# EAGLE schematic mt15_pla (EAGLE 6.6.0), part 1 of 2

## Sheet 1 of 9
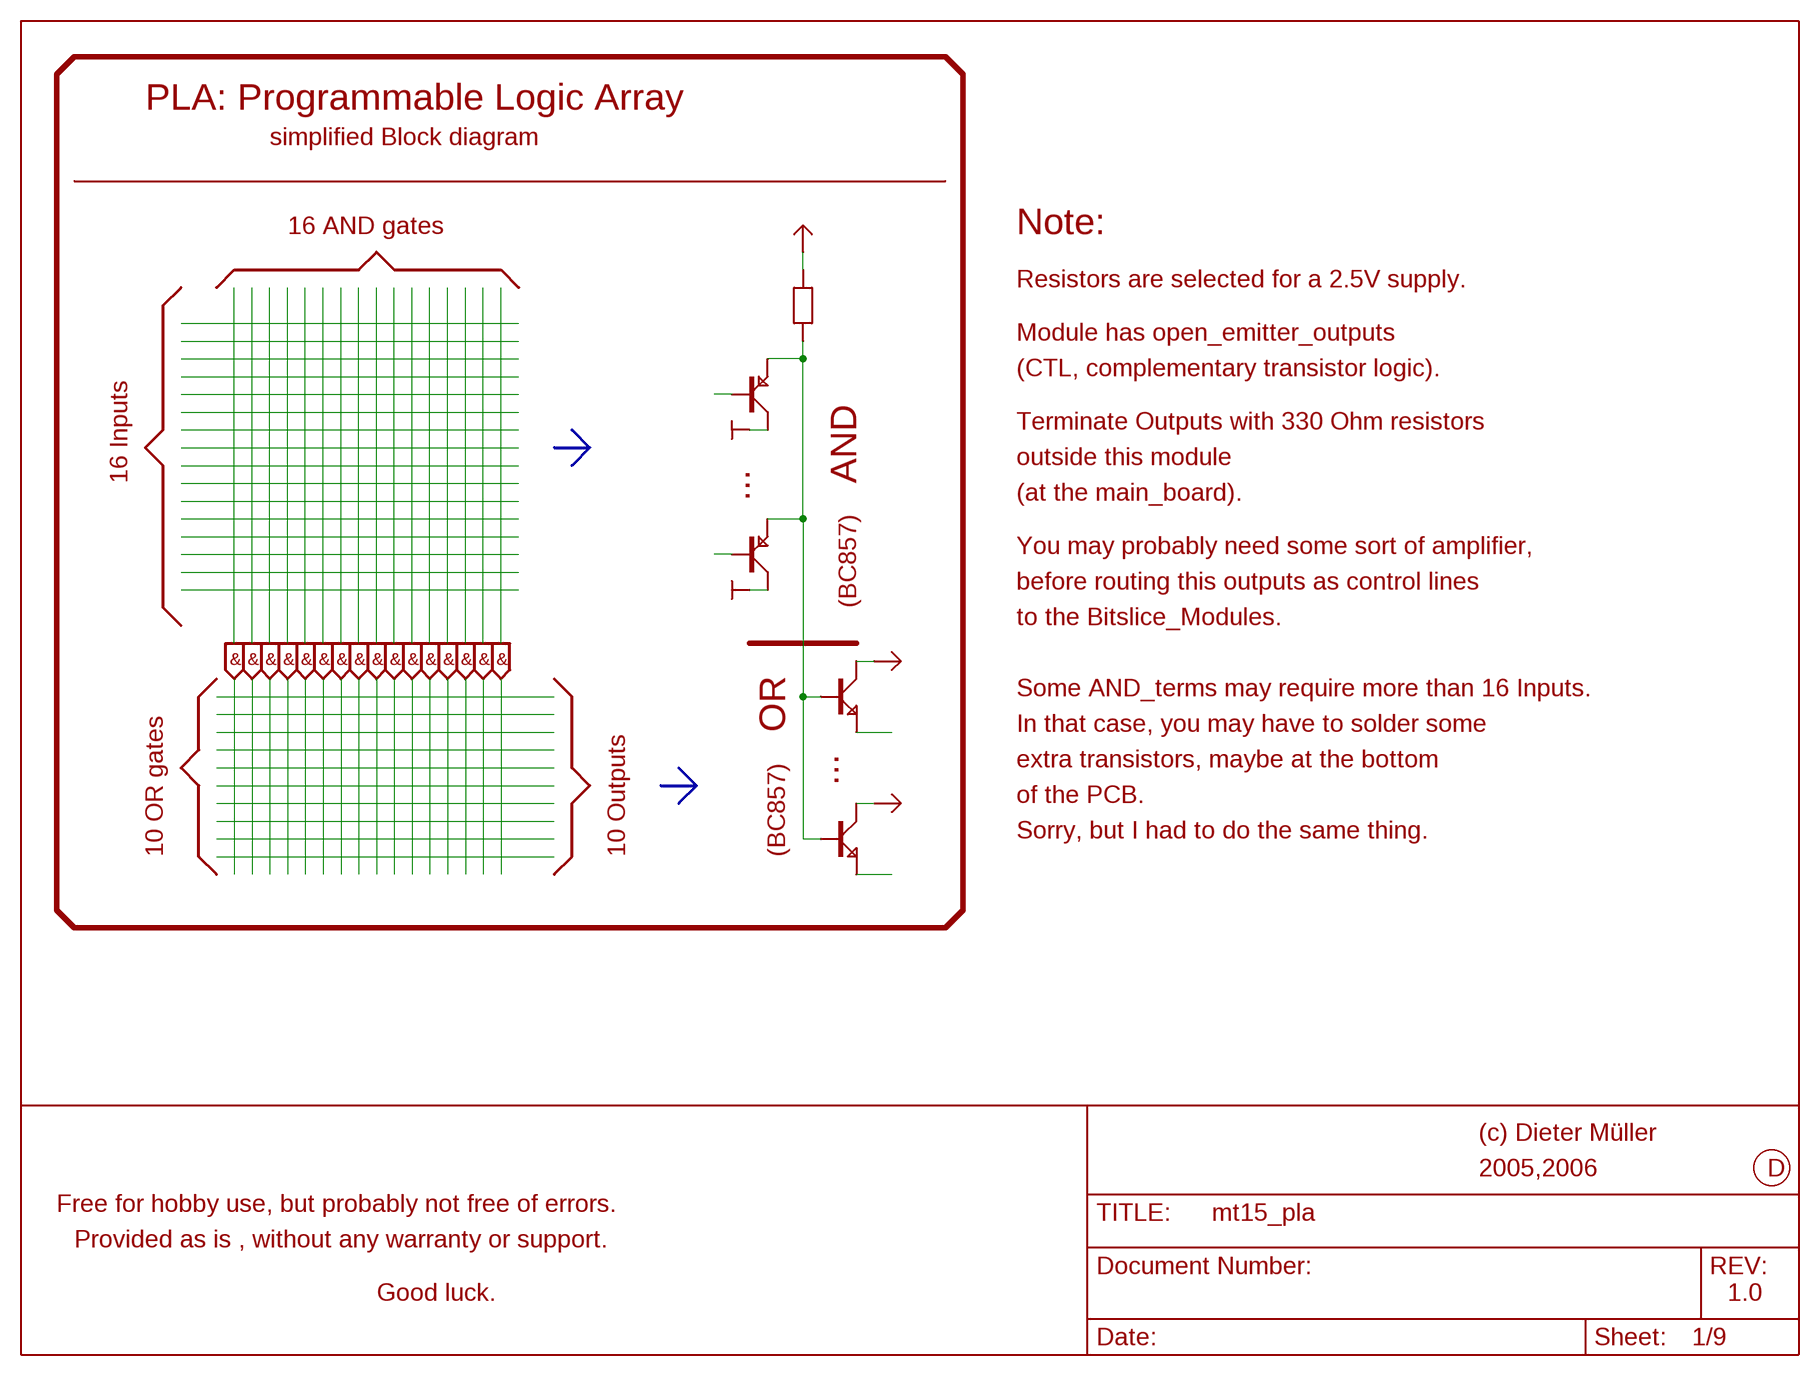
[diagram p0: schematic, sheet 1]

### Buses
B$16
B$17

### Notes on the sheet
- PLA: Programmable Logic Array
- simplified Block diagram
- 16 AND gates | Note:
- Resistors are selected for a 2.5V supply.
- Module has open_emitter_outputs
- (CTL, complementary transistor logic).
- Terminate Outputs with 330 Ohm resistors
- outside this module
- 16 Inputs | AND
- ... | (at the main_board).
- You may probably need some sort of amplifier,
- before routing this outputs as control lines
- (BC857)
- to the Bitslice_Modules.
- & | & | & | & | & | & | & | & | & | & | & | & | & | & | & | &
- Some AND_terms may require more than 16 Inputs.
- OR | In that case, you may have to solder some
- extra transistors, maybe at the bottom
- ...
- of the PCB.
- Sorry, but I had to do the same thing.
- 10 OR gates | 10 Outputs | (BC857)
- (c) Dieter Müller
- 2005,2006 | D
- Free for hobby use, but probably not free of errors.
- Provided as is , without any warranty or support.
- Good luck. | 1.0
- Was die Politiker versprechen, ist schon toll.
- Mit ihren Lügen quatschen sie den Wähler voll.
- All das Reformgebrabbel und die Rangelei.
- Der Wähler sitzt nur da und weint dabei.
- Aber ihre grösste Hoffnung ist,
- dass er diesen ganzen Quatsch vergisst.
- Wenn nicht, dann ist das alles nicht so schlimm.
- Solang' er macht sein Kreuzchen richtig hin.

## Sheet 2 of 9
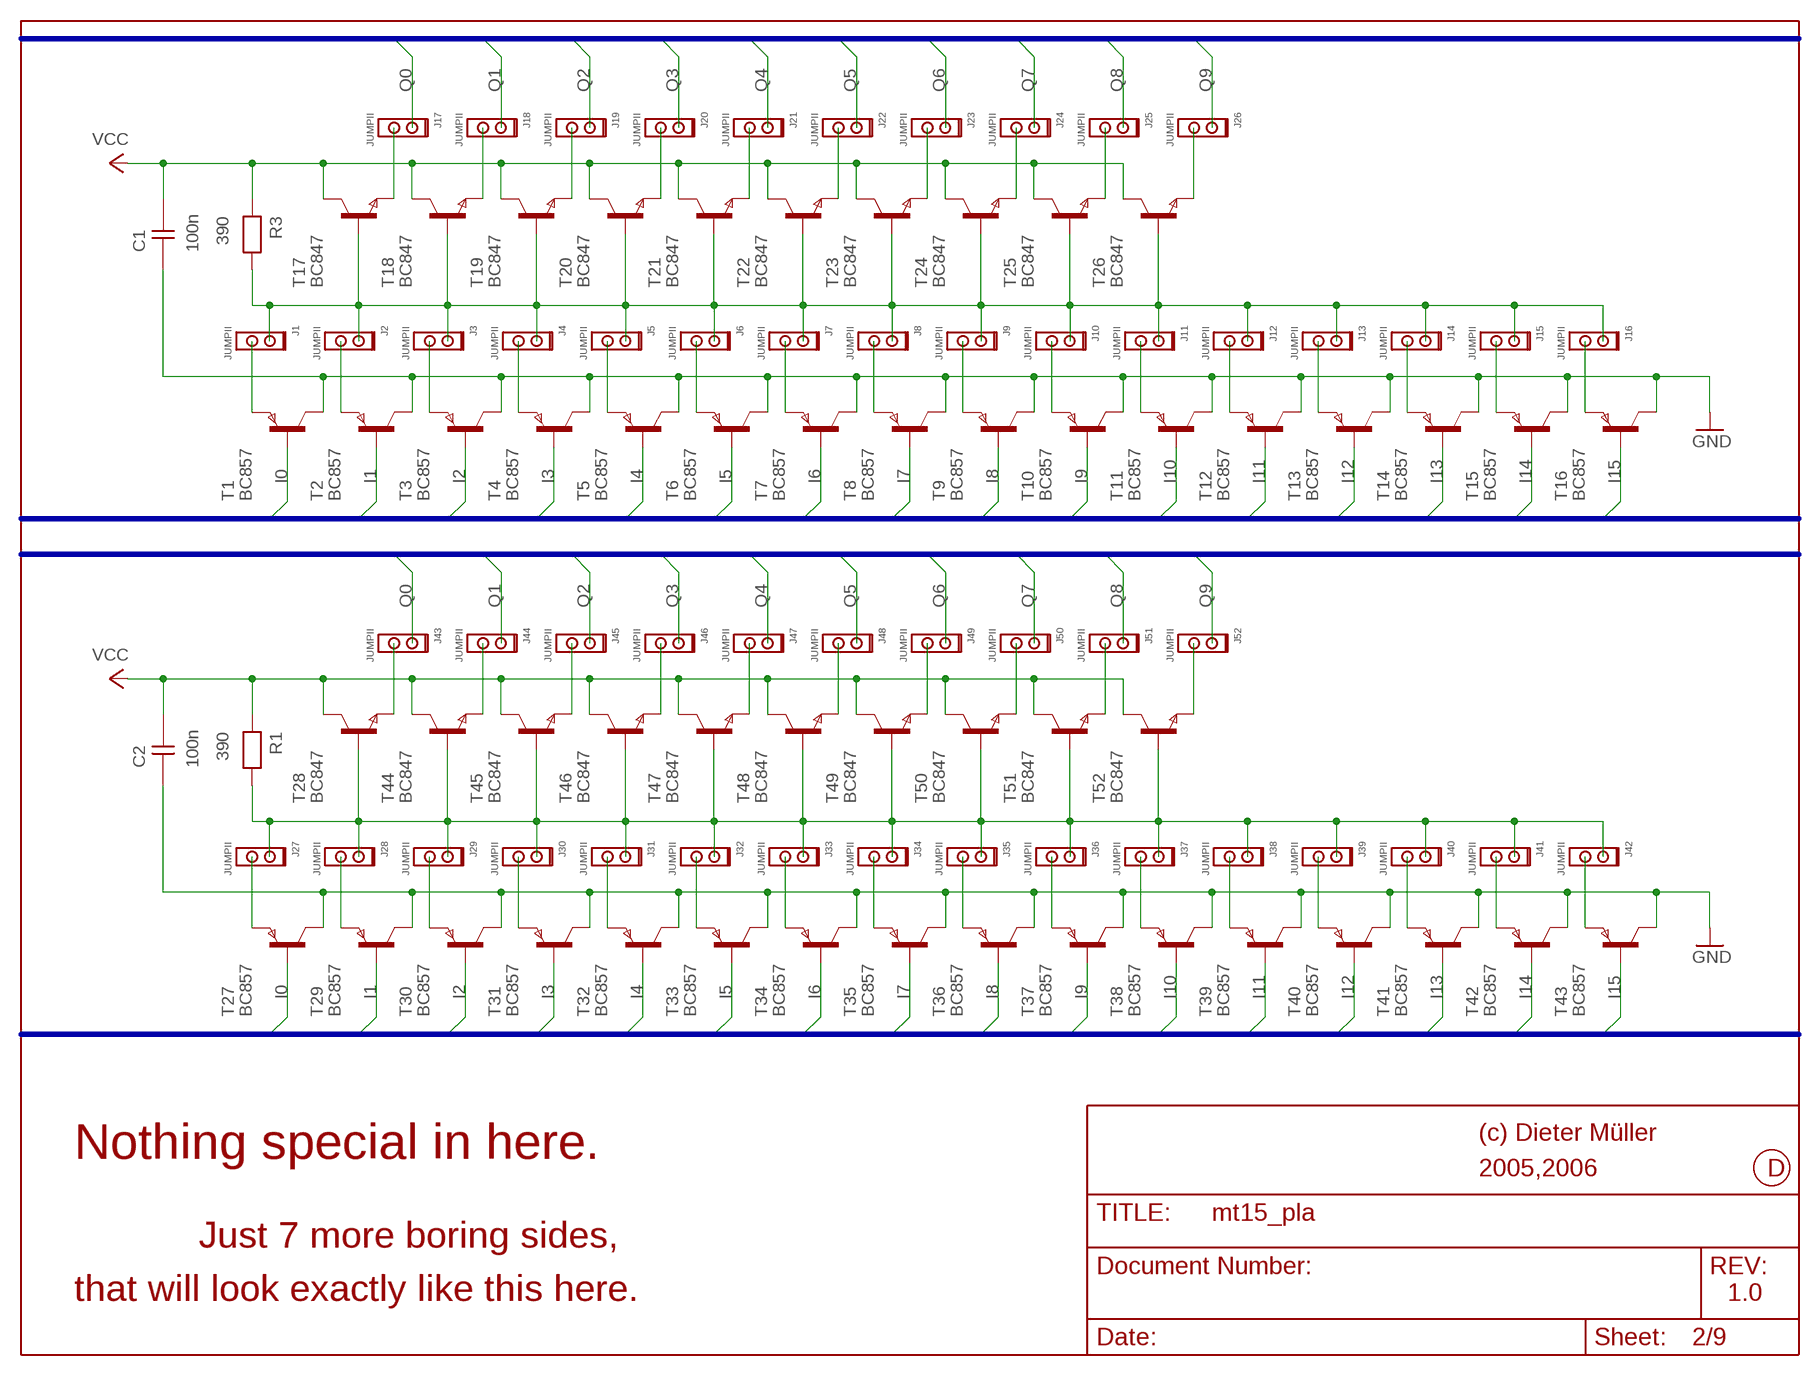
[diagram p1: schematic, sheet 2]

### Parts
C1  100n  CAPNP-5  [0204]
C2  100n  CAPNP-5  [0204]
J1  JUMPII  JUMPII@2  [JUMPII]
J2  JUMPII  JUMPII@2  [JUMPII]
J3  JUMPII  JUMPII@2  [JUMPII]
J4  JUMPII  JUMPII@2  [JUMPII]
J5  JUMPII  JUMPII@2  [JUMPII]
J6  JUMPII  JUMPII@2  [JUMPII]
J7  JUMPII  JUMPII@2  [JUMPII]
J8  JUMPII  JUMPII@2  [JUMPII]
J9  JUMPII  JUMPII@2  [JUMPII]
J10  JUMPII  JUMPII@2  [JUMPII]
J11  JUMPII  JUMPII@2  [JUMPII]
J12  JUMPII  JUMPII@2  [JUMPII]
J13  JUMPII  JUMPII@2  [JUMPII]
J14  JUMPII  JUMPII@2  [JUMPII]
J15  JUMPII  JUMPII@2  [JUMPII]
J16  JUMPII  JUMPII@2  [JUMPII]
J17  JUMPII  JUMPII@2  [JUMPII]
J18  JUMPII  JUMPII@2  [JUMPII]
J19  JUMPII  JUMPII@2  [JUMPII]
J20  JUMPII  JUMPII@2  [JUMPII]
J21  JUMPII  JUMPII@2  [JUMPII]
J22  JUMPII  JUMPII@2  [JUMPII]
J23  JUMPII  JUMPII@2  [JUMPII]
J24  JUMPII  JUMPII@2  [JUMPII]
J25  JUMPII  JUMPII@2  [JUMPII]
J26  JUMPII  JUMPII@2  [JUMPII]
J27  JUMPII  JUMPII@2  [JUMPII]
J28  JUMPII  JUMPII@2  [JUMPII]
J29  JUMPII  JUMPII@2  [JUMPII]
J30  JUMPII  JUMPII@2  [JUMPII]
J31  JUMPII  JUMPII@2  [JUMPII]
J32  JUMPII  JUMPII@2  [JUMPII]
J33  JUMPII  JUMPII@2  [JUMPII]
J34  JUMPII  JUMPII@2  [JUMPII]
J35  JUMPII  JUMPII@2  [JUMPII]
J36  JUMPII  JUMPII@2  [JUMPII]
J37  JUMPII  JUMPII@2  [JUMPII]
J38  JUMPII  JUMPII@2  [JUMPII]
J39  JUMPII  JUMPII@2  [JUMPII]
J40  JUMPII  JUMPII@2  [JUMPII]
J41  JUMPII  JUMPII@2  [JUMPII]
J42  JUMPII  JUMPII@2  [JUMPII]
J43  JUMPII  JUMPII@2  [JUMPII]
J44  JUMPII  JUMPII@2  [JUMPII]
J45  JUMPII  JUMPII@2  [JUMPII]
J46  JUMPII  JUMPII@2  [JUMPII]
J47  JUMPII  JUMPII@2  [JUMPII]
J48  JUMPII  JUMPII@2  [JUMPII]
J49  JUMPII  JUMPII@2  [JUMPII]
J50  JUMPII  JUMPII@2  [JUMPII]
J51  JUMPII  JUMPII@2  [JUMPII]
J52  JUMPII  JUMPII@2  [JUMPII]
R1  390  RESEU-7,5  [0204]
R3  390  RESEU-7,5  [0204]
T1  BC857  BC557  [SOT-23]
T2  BC857  BC557  [SOT-23]
T3  BC857  BC557  [SOT-23]
T4  BC857  BC557  [SOT-23]
T5  BC857  BC557  [SOT-23]
T6  BC857  BC557  [SOT-23]
T7  BC857  BC557  [SOT-23]
T8  BC857  BC557  [SOT-23]
T9  BC857  BC557  [SOT-23]
T10  BC857  BC557  [SOT-23]
T11  BC857  BC557  [SOT-23]
T12  BC857  BC557  [SOT-23]
T13  BC857  BC557  [SOT-23]
T14  BC857  BC557  [SOT-23]
T15  BC857  BC557  [SOT-23]
T16  BC857  BC557  [SOT-23]
T17  BC847  BC547  [SOT-23]
T18  BC847  BC547  [SOT-23]
T19  BC847  BC547  [SOT-23]
T20  BC847  BC547  [SOT-23]
T21  BC847  BC547  [SOT-23]
T22  BC847  BC547  [SOT-23]
T23  BC847  BC547  [SOT-23]
T24  BC847  BC547  [SOT-23]
T25  BC847  BC547  [SOT-23]
T26  BC847  BC547  [SOT-23]
T27  BC857  BC557  [SOT-23]
T28  BC847  BC547  [SOT-23]
T29  BC857  BC557  [SOT-23]
T30  BC857  BC557  [SOT-23]
T31  BC857  BC557  [SOT-23]
T32  BC857  BC557  [SOT-23]
T33  BC857  BC557  [SOT-23]
T34  BC857  BC557  [SOT-23]
T35  BC857  BC557  [SOT-23]
T36  BC857  BC557  [SOT-23]
T37  BC857  BC557  [SOT-23]
T38  BC857  BC557  [SOT-23]
T39  BC857  BC557  [SOT-23]
T40  BC857  BC557  [SOT-23]
T41  BC857  BC557  [SOT-23]
T42  BC857  BC557  [SOT-23]
T43  BC857  BC557  [SOT-23]
T44  BC847  BC547  [SOT-23]
T45  BC847  BC547  [SOT-23]
T46  BC847  BC547  [SOT-23]
T47  BC847  BC547  [SOT-23]
T48  BC847  BC547  [SOT-23]
T49  BC847  BC547  [SOT-23]
T50  BC847  BC547  [SOT-23]
T51  BC847  BC547  [SOT-23]
T52  BC847  BC547  [SOT-23]

### Nets
GND: C1.1 C2.1 T1.3(C) T2.3(C) T3.3(C) T4.3(C) T5.3(C) T6.3(C) T7.3(C) T8.3(C) T9.3(C) T10.3(C) T11.3(C) T12.3(C) T13.3(C) T14.3(C) T15.3(C) T16.3(C) T27.3(C) T29.3(C) T30.3(C) T31.3(C) T32.3(C) T33.3(C) T34.3(C) T35.3(C) T36.3(C) T37.3(C) T38.3(C) T39.3(C) T40.3(C) T41.3(C) T42.3(C) T43.3(C) ; also sheet 1,3,4,5,6,7,8,9
I0: T1.2(B) T27.2(B) ; also sheet 3,4,5,6,7,8,9
I1: T2.2(B) T29.2(B) ; also sheet 3,4,5,6,7,8,9
I2: T3.2(B) T30.2(B) ; also sheet 3,4,5,6,7,8,9
I3: T4.2(B) T31.2(B) ; also sheet 3,4,5,6,7,8,9
I4: T5.2(B) T32.2(B) ; also sheet 3,4,5,6,7,8,9
I5: T6.2(B) T33.2(B) ; also sheet 3,4,5,6,7,8,9
I6: T7.2(B) T34.2(B) ; also sheet 3,4,5,6,7,8,9
I7: T8.2(B) T35.2(B) ; also sheet 3,4,5,6,7,8,9
I8: T9.2(B) T36.2(B) ; also sheet 3,4,5,6,7,8,9
I9: T10.2(B) T37.2(B) ; also sheet 3,4,5,6,7,8,9
I10: T11.2(B) T38.2(B) ; also sheet 3,4,5,6,7,8,9
I11: T12.2(B) T39.2(B) ; also sheet 3,4,5,6,7,8,9
I12: T13.2(B) T40.2(B) ; also sheet 3,4,5,6,7,8,9
I13: T14.2(B) T41.2(B) ; also sheet 3,4,5,6,7,8,9
I14: T15.2(B) T42.2(B) ; also sheet 3,4,5,6,7,8,9
I15: T16.2(B) T43.2(B) ; also sheet 3,4,5,6,7,8,9
N$1: J1.2 T1.1(E)
N$2: J2.2 T2.1(E)
N$3: J3.2 T3.1(E)
N$4: J1.1 J2.1 J3.1 J4.1 J5.1 J6.1 J7.1 J8.1 J9.1 J10.1 J11.1 J12.1 J13.1 J14.1 J15.1 J16.1 R3.2 T17.2(B) T18.2(B) T19.2(B) T20.2(B) T21.2(B) T22.2(B) T23.2(B) T24.2(B) T25.2(B) T26.2(B)
N$5: J16.2 T16.1(E)
N$6: J15.2 T15.1(E)
N$7: J14.2 T14.1(E)
N$8: J13.2 T13.1(E)
N$9: J12.2 T12.1(E)
N$10: J6.2 T6.1(E)
N$11: J5.2 T5.1(E)
N$12: J4.2 T4.1(E)
N$13: J7.2 T7.1(E)
N$14: J8.2 T8.1(E)
N$15: J9.2 T9.1(E)
N$16: J10.2 T10.1(E)
N$17: J11.2 T11.1(E)
N$18: J27.2 T27.1(E)
N$19: J28.2 T29.1(E)
N$20: J29.2 T30.1(E)
N$21: J27.1 J28.1 J29.1 J30.1 J31.1 J32.1 J33.1 J34.1 J35.1 J36.1 J37.1 J38.1 J39.1 J40.1 J41.1 J42.1 R1.2 T28.2(B) T44.2(B) T45.2(B) T46.2(B) T47.2(B) T48.2(B) T49.2(B) T50.2(B) T51.2(B) T52.2(B)
N$22: J42.2 T43.1(E)
N$23: J41.2 T42.1(E)
N$24: J26.2 T26.1(E)
N$25: J17.2 T17.1(E)
N$26: J18.2 T18.1(E)
N$27: J19.2 T19.1(E)
N$28: J20.2 T20.1(E)
N$29: J21.2 T21.1(E)
N$30: J22.2 T22.1(E)
N$31: J23.2 T23.1(E)
N$32: J24.2 T24.1(E)
N$33: J25.2 T25.1(E)
N$34: J40.2 T41.1(E)
N$35: J39.2 T40.1(E)
N$36: J38.2 T39.1(E)
N$37: J32.2 T33.1(E)
N$38: J31.2 T32.1(E)
N$39: J30.2 T31.1(E)
N$40: J33.2 T34.1(E)
N$41: J34.2 T35.1(E)
N$42: J35.2 T36.1(E)
N$43: J36.2 T37.1(E)
N$44: J37.2 T38.1(E)
N$45: J52.2 T52.1(E)
N$46: J43.2 T28.1(E)
N$47: J44.2 T44.1(E)
N$48: J45.2 T45.1(E)
N$49: J46.2 T46.1(E)
N$50: J47.2 T47.1(E)
N$51: J48.2 T48.1(E)
N$52: J49.2 T49.1(E)
N$53: J50.2 T50.1(E)
N$54: J51.2 T51.1(E)
Q0: J17.1 J43.1 ; also sheet 3,4,5,6,7,8,9
Q1: J18.1 J44.1 ; also sheet 3,4,5,6,7,8,9
Q2: J19.1 J45.1 ; also sheet 3,4,5,6,7,8,9
Q3: J20.1 J46.1 ; also sheet 3,4,5,6,7,8,9
Q4: J21.1 J47.1 ; also sheet 3,4,5,6,7,8,9
Q5: J22.1 J48.1 ; also sheet 3,4,5,6,7,8,9
Q6: J23.1 J49.1 ; also sheet 3,4,5,6,7,8,9
Q7: J24.1 J50.1 ; also sheet 3,4,5,6,7,8,9
Q8: J25.1 J51.1 ; also sheet 3,4,5,6,7,8,9
Q9: J26.1 J52.1 ; also sheet 3,4,5,6,7,8,9
VCC: C1.2 C2.2 R1.1 R3.1 T17.3(C) T18.3(C) T19.3(C) T20.3(C) T21.3(C) T22.3(C) T23.3(C) T24.3(C) T25.3(C) T26.3(C) T28.3(C) T44.3(C) T45.3(C) T46.3(C) T47.3(C) T48.3(C) T49.3(C) T50.3(C) T51.3(C) T52.3(C) ; also sheet 1,3,4,5,6,7,8,9

### Buses
B$1
B$3

### Notes on the sheet
- (c) Dieter Müller
- Nothing special in here.
- 2005,2006 | D
- Just 7 more boring sides,
- that will look exactly like this here. | 1.0

## Sheet 3 of 9
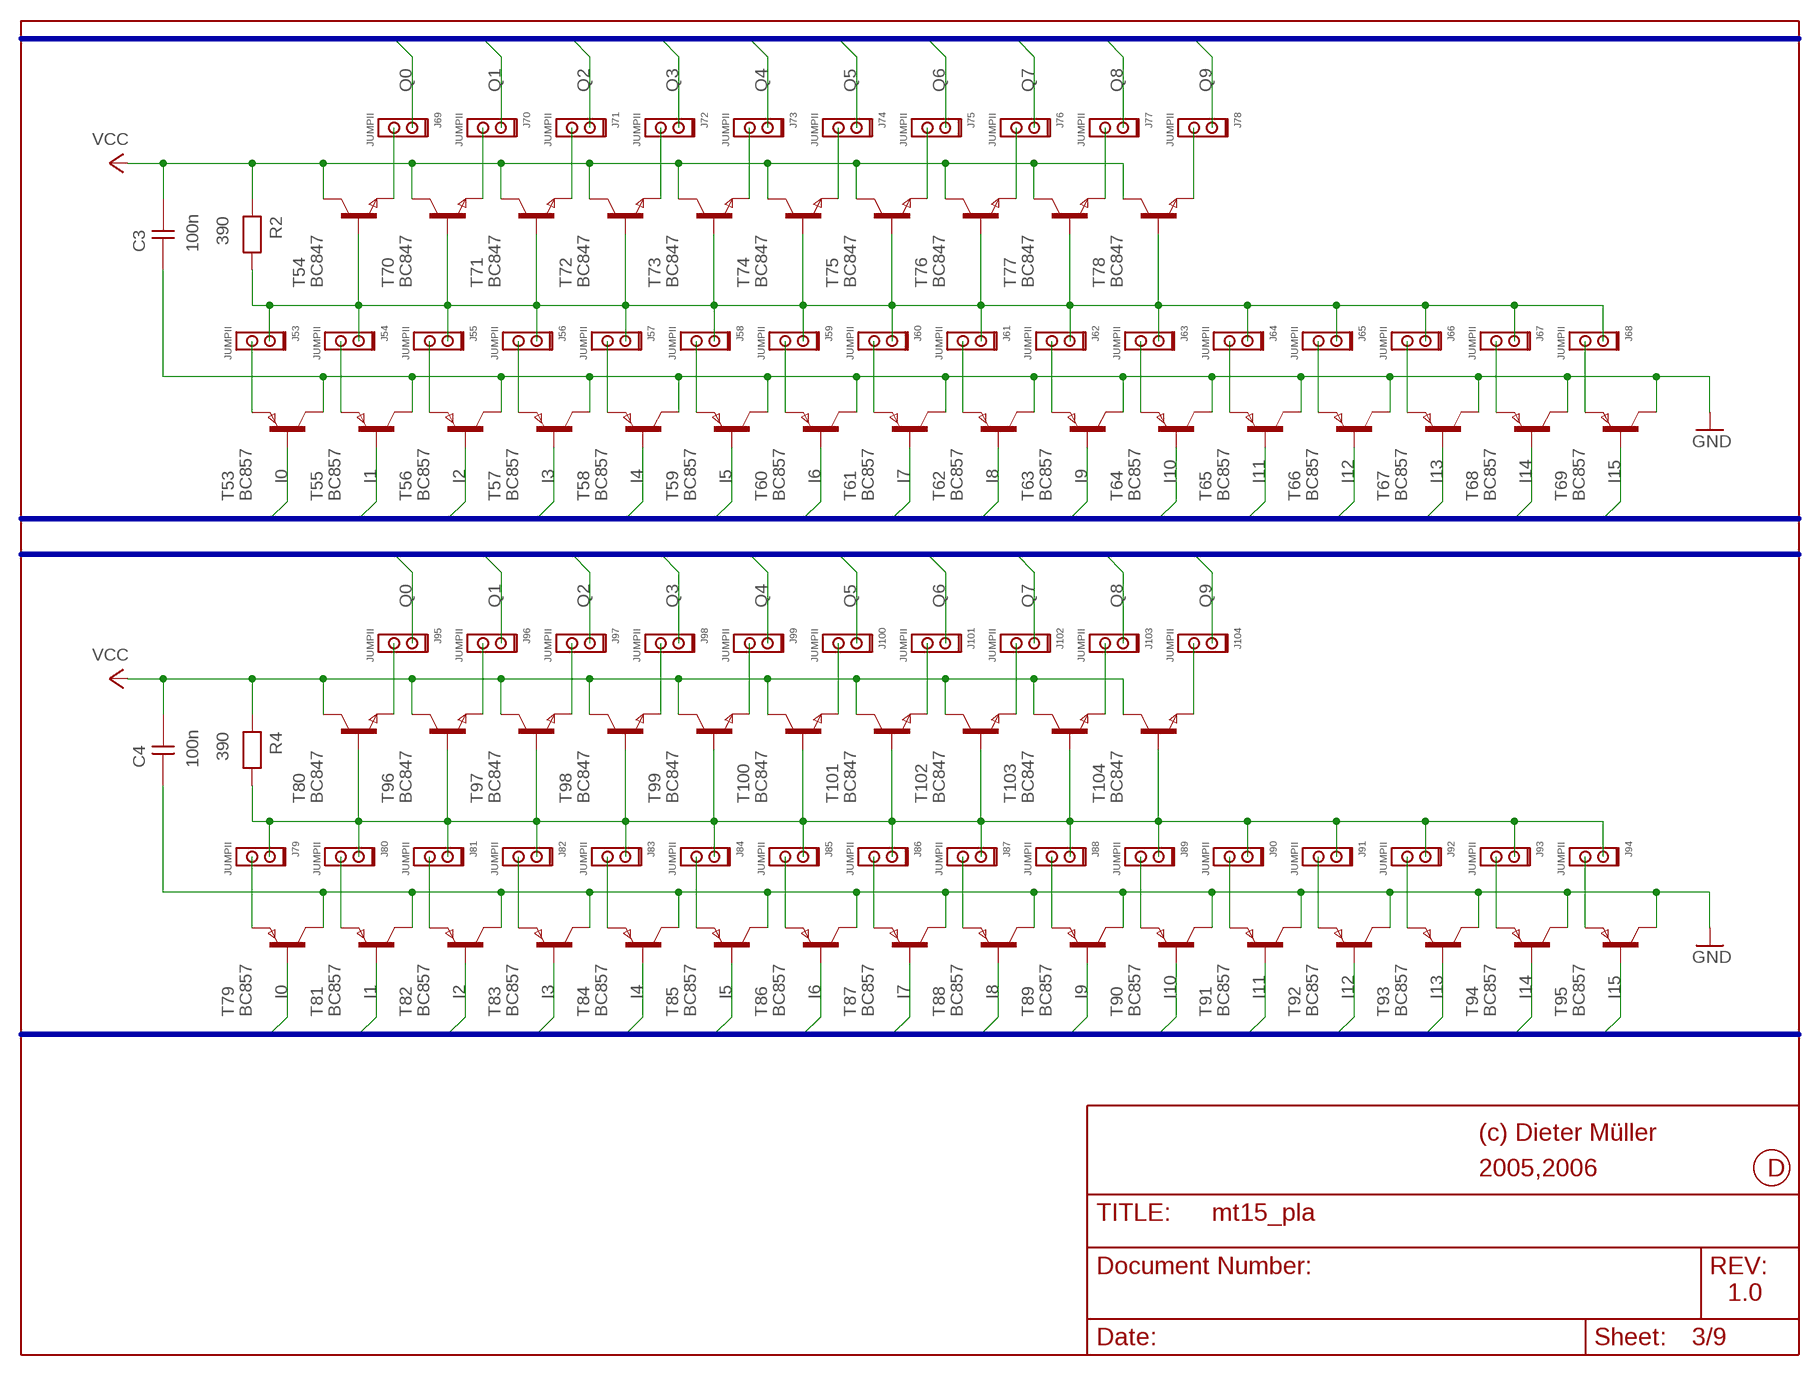
[diagram p2: schematic, sheet 3]

### Parts
C3  100n  CAPNP-5  [0204]
C4  100n  CAPNP-5  [0204]
J53  JUMPII  JUMPII@2  [JUMPII]
J54  JUMPII  JUMPII@2  [JUMPII]
J55  JUMPII  JUMPII@2  [JUMPII]
J56  JUMPII  JUMPII@2  [JUMPII]
J57  JUMPII  JUMPII@2  [JUMPII]
J58  JUMPII  JUMPII@2  [JUMPII]
J59  JUMPII  JUMPII@2  [JUMPII]
J60  JUMPII  JUMPII@2  [JUMPII]
J61  JUMPII  JUMPII@2  [JUMPII]
J62  JUMPII  JUMPII@2  [JUMPII]
J63  JUMPII  JUMPII@2  [JUMPII]
J64  JUMPII  JUMPII@2  [JUMPII]
J65  JUMPII  JUMPII@2  [JUMPII]
J66  JUMPII  JUMPII@2  [JUMPII]
J67  JUMPII  JUMPII@2  [JUMPII]
J68  JUMPII  JUMPII@2  [JUMPII]
J69  JUMPII  JUMPII@2  [JUMPII]
J70  JUMPII  JUMPII@2  [JUMPII]
J71  JUMPII  JUMPII@2  [JUMPII]
J72  JUMPII  JUMPII@2  [JUMPII]
J73  JUMPII  JUMPII@2  [JUMPII]
J74  JUMPII  JUMPII@2  [JUMPII]
J75  JUMPII  JUMPII@2  [JUMPII]
J76  JUMPII  JUMPII@2  [JUMPII]
J77  JUMPII  JUMPII@2  [JUMPII]
J78  JUMPII  JUMPII@2  [JUMPII]
J79  JUMPII  JUMPII@2  [JUMPII]
J80  JUMPII  JUMPII@2  [JUMPII]
J81  JUMPII  JUMPII@2  [JUMPII]
J82  JUMPII  JUMPII@2  [JUMPII]
J83  JUMPII  JUMPII@2  [JUMPII]
J84  JUMPII  JUMPII@2  [JUMPII]
J85  JUMPII  JUMPII@2  [JUMPII]
J86  JUMPII  JUMPII@2  [JUMPII]
J87  JUMPII  JUMPII@2  [JUMPII]
J88  JUMPII  JUMPII@2  [JUMPII]
J89  JUMPII  JUMPII@2  [JUMPII]
J90  JUMPII  JUMPII@2  [JUMPII]
J91  JUMPII  JUMPII@2  [JUMPII]
J92  JUMPII  JUMPII@2  [JUMPII]
J93  JUMPII  JUMPII@2  [JUMPII]
J94  JUMPII  JUMPII@2  [JUMPII]
J95  JUMPII  JUMPII@2  [JUMPII]
J96  JUMPII  JUMPII@2  [JUMPII]
J97  JUMPII  JUMPII@2  [JUMPII]
J98  JUMPII  JUMPII@2  [JUMPII]
J99  JUMPII  JUMPII@2  [JUMPII]
J100  JUMPII  JUMPII@2  [JUMPII]
J101  JUMPII  JUMPII@2  [JUMPII]
J102  JUMPII  JUMPII@2  [JUMPII]
J103  JUMPII  JUMPII@2  [JUMPII]
J104  JUMPII  JUMPII@2  [JUMPII]
R2  390  RESEU-7,5  [0204]
R4  390  RESEU-7,5  [0204]
T53  BC857  BC557  [SOT-23]
T54  BC847  BC547  [SOT-23]
T55  BC857  BC557  [SOT-23]
T56  BC857  BC557  [SOT-23]
T57  BC857  BC557  [SOT-23]
T58  BC857  BC557  [SOT-23]
T59  BC857  BC557  [SOT-23]
T60  BC857  BC557  [SOT-23]
T61  BC857  BC557  [SOT-23]
T62  BC857  BC557  [SOT-23]
T63  BC857  BC557  [SOT-23]
T64  BC857  BC557  [SOT-23]
T65  BC857  BC557  [SOT-23]
T66  BC857  BC557  [SOT-23]
T67  BC857  BC557  [SOT-23]
T68  BC857  BC557  [SOT-23]
T69  BC857  BC557  [SOT-23]
T70  BC847  BC547  [SOT-23]
T71  BC847  BC547  [SOT-23]
T72  BC847  BC547  [SOT-23]
T73  BC847  BC547  [SOT-23]
T74  BC847  BC547  [SOT-23]
T75  BC847  BC547  [SOT-23]
T76  BC847  BC547  [SOT-23]
T77  BC847  BC547  [SOT-23]
T78  BC847  BC547  [SOT-23]
T79  BC857  BC557  [SOT-23]
T80  BC847  BC547  [SOT-23]
T81  BC857  BC557  [SOT-23]
T82  BC857  BC557  [SOT-23]
T83  BC857  BC557  [SOT-23]
T84  BC857  BC557  [SOT-23]
T85  BC857  BC557  [SOT-23]
T86  BC857  BC557  [SOT-23]
T87  BC857  BC557  [SOT-23]
T88  BC857  BC557  [SOT-23]
T89  BC857  BC557  [SOT-23]
T90  BC857  BC557  [SOT-23]
T91  BC857  BC557  [SOT-23]
T92  BC857  BC557  [SOT-23]
T93  BC857  BC557  [SOT-23]
T94  BC857  BC557  [SOT-23]
T95  BC857  BC557  [SOT-23]
T96  BC847  BC547  [SOT-23]
T97  BC847  BC547  [SOT-23]
T98  BC847  BC547  [SOT-23]
T99  BC847  BC547  [SOT-23]
T100  BC847  BC547  [SOT-23]
T101  BC847  BC547  [SOT-23]
T102  BC847  BC547  [SOT-23]
T103  BC847  BC547  [SOT-23]
T104  BC847  BC547  [SOT-23]

### Nets
GND: C3.1 C4.1 T53.3(C) T55.3(C) T56.3(C) T57.3(C) T58.3(C) T59.3(C) T60.3(C) T61.3(C) T62.3(C) T63.3(C) T64.3(C) T65.3(C) T66.3(C) T67.3(C) T68.3(C) T69.3(C) T79.3(C) T81.3(C) T82.3(C) T83.3(C) T84.3(C) T85.3(C) T86.3(C) T87.3(C) T88.3(C) T89.3(C) T90.3(C) T91.3(C) T92.3(C) T93.3(C) T94.3(C) T95.3(C) ; also sheet 1,2,4,5,6,7,8,9
I0: T53.2(B) T79.2(B) ; also sheet 2,4,5,6,7,8,9
I1: T55.2(B) T81.2(B) ; also sheet 2,4,5,6,7,8,9
I2: T56.2(B) T82.2(B) ; also sheet 2,4,5,6,7,8,9
I3: T57.2(B) T83.2(B) ; also sheet 2,4,5,6,7,8,9
I4: T58.2(B) T84.2(B) ; also sheet 2,4,5,6,7,8,9
I5: T59.2(B) T85.2(B) ; also sheet 2,4,5,6,7,8,9
I6: T60.2(B) T86.2(B) ; also sheet 2,4,5,6,7,8,9
I7: T61.2(B) T87.2(B) ; also sheet 2,4,5,6,7,8,9
I8: T62.2(B) T88.2(B) ; also sheet 2,4,5,6,7,8,9
I9: T63.2(B) T89.2(B) ; also sheet 2,4,5,6,7,8,9
I10: T64.2(B) T90.2(B) ; also sheet 2,4,5,6,7,8,9
I11: T65.2(B) T91.2(B) ; also sheet 2,4,5,6,7,8,9
I12: T66.2(B) T92.2(B) ; also sheet 2,4,5,6,7,8,9
I13: T67.2(B) T93.2(B) ; also sheet 2,4,5,6,7,8,9
I14: T68.2(B) T94.2(B) ; also sheet 2,4,5,6,7,8,9
I15: T69.2(B) T95.2(B) ; also sheet 2,4,5,6,7,8,9
N$55: J53.2 T53.1(E)
N$56: J54.2 T55.1(E)
N$57: J55.2 T56.1(E)
N$58: J53.1 J54.1 J55.1 J56.1 J57.1 J58.1 J59.1 J60.1 J61.1 J62.1 J63.1 J64.1 J65.1 J66.1 J67.1 J68.1 R2.2 T54.2(B) T70.2(B) T71.2(B) T72.2(B) T73.2(B) T74.2(B) T75.2(B) T76.2(B) T77.2(B) T78.2(B)
N$59: J68.2 T69.1(E)
N$60: J67.2 T68.1(E)
N$61: J66.2 T67.1(E)
N$62: J65.2 T66.1(E)
N$63: J64.2 T65.1(E)
N$64: J58.2 T59.1(E)
N$65: J57.2 T58.1(E)
N$66: J56.2 T57.1(E)
N$67: J59.2 T60.1(E)
N$68: J60.2 T61.1(E)
N$69: J61.2 T62.1(E)
N$70: J62.2 T63.1(E)
N$71: J63.2 T64.1(E)
N$72: J78.2 T78.1(E)
N$73: J69.2 T54.1(E)
N$74: J70.2 T70.1(E)
N$75: J71.2 T71.1(E)
N$76: J72.2 T72.1(E)
N$77: J73.2 T73.1(E)
N$78: J74.2 T74.1(E)
N$79: J75.2 T75.1(E)
N$80: J76.2 T76.1(E)
N$81: J77.2 T77.1(E)
N$82: J79.2 T79.1(E)
N$83: J80.2 T81.1(E)
N$84: J81.2 T82.1(E)
N$85: J79.1 J80.1 J81.1 J82.1 J83.1 J84.1 J85.1 J86.1 J87.1 J88.1 J89.1 J90.1 J91.1 J92.1 J93.1 J94.1 R4.2 T80.2(B) T96.2(B) T97.2(B) T98.2(B) T99.2(B) T100.2(B) T101.2(B) T102.2(B) T103.2(B) T104.2(B)
N$86: J94.2 T95.1(E)
N$87: J93.2 T94.1(E)
N$88: J92.2 T93.1(E)
N$89: J91.2 T92.1(E)
N$90: J90.2 T91.1(E)
N$91: J84.2 T85.1(E)
N$92: J83.2 T84.1(E)
N$93: J82.2 T83.1(E)
N$94: J85.2 T86.1(E)
N$95: J86.2 T87.1(E)
N$96: J87.2 T88.1(E)
N$97: J88.2 T89.1(E)
N$98: J89.2 T90.1(E)
N$99: J104.2 T104.1(E)
N$100: J95.2 T80.1(E)
N$101: J96.2 T96.1(E)
N$102: J97.2 T97.1(E)
N$103: J98.2 T98.1(E)
N$104: J99.2 T99.1(E)
N$105: J100.2 T100.1(E)
N$106: J101.2 T101.1(E)
N$107: J102.2 T102.1(E)
N$108: J103.2 T103.1(E)
Q0: J69.1 J95.1 ; also sheet 2,4,5,6,7,8,9
Q1: J70.1 J96.1 ; also sheet 2,4,5,6,7,8,9
Q2: J71.1 J97.1 ; also sheet 2,4,5,6,7,8,9
Q3: J72.1 J98.1 ; also sheet 2,4,5,6,7,8,9
Q4: J73.1 J99.1 ; also sheet 2,4,5,6,7,8,9
Q5: J74.1 J100.1 ; also sheet 2,4,5,6,7,8,9
Q6: J75.1 J101.1 ; also sheet 2,4,5,6,7,8,9
Q7: J76.1 J102.1 ; also sheet 2,4,5,6,7,8,9
Q8: J77.1 J103.1 ; also sheet 2,4,5,6,7,8,9
Q9: J78.1 J104.1 ; also sheet 2,4,5,6,7,8,9
VCC: C3.2 C4.2 R2.1 R4.1 T54.3(C) T70.3(C) T71.3(C) T72.3(C) T73.3(C) T74.3(C) T75.3(C) T76.3(C) T77.3(C) T78.3(C) T80.3(C) T96.3(C) T97.3(C) T98.3(C) T99.3(C) T100.3(C) T101.3(C) T102.3(C) T103.3(C) T104.3(C) ; also sheet 1,2,4,5,6,7,8,9

### Buses
B$1
B$3

### Notes on the sheet
- (c) Dieter Müller
- 2005,2006 | D
- 1.0

## Sheet 4 of 9
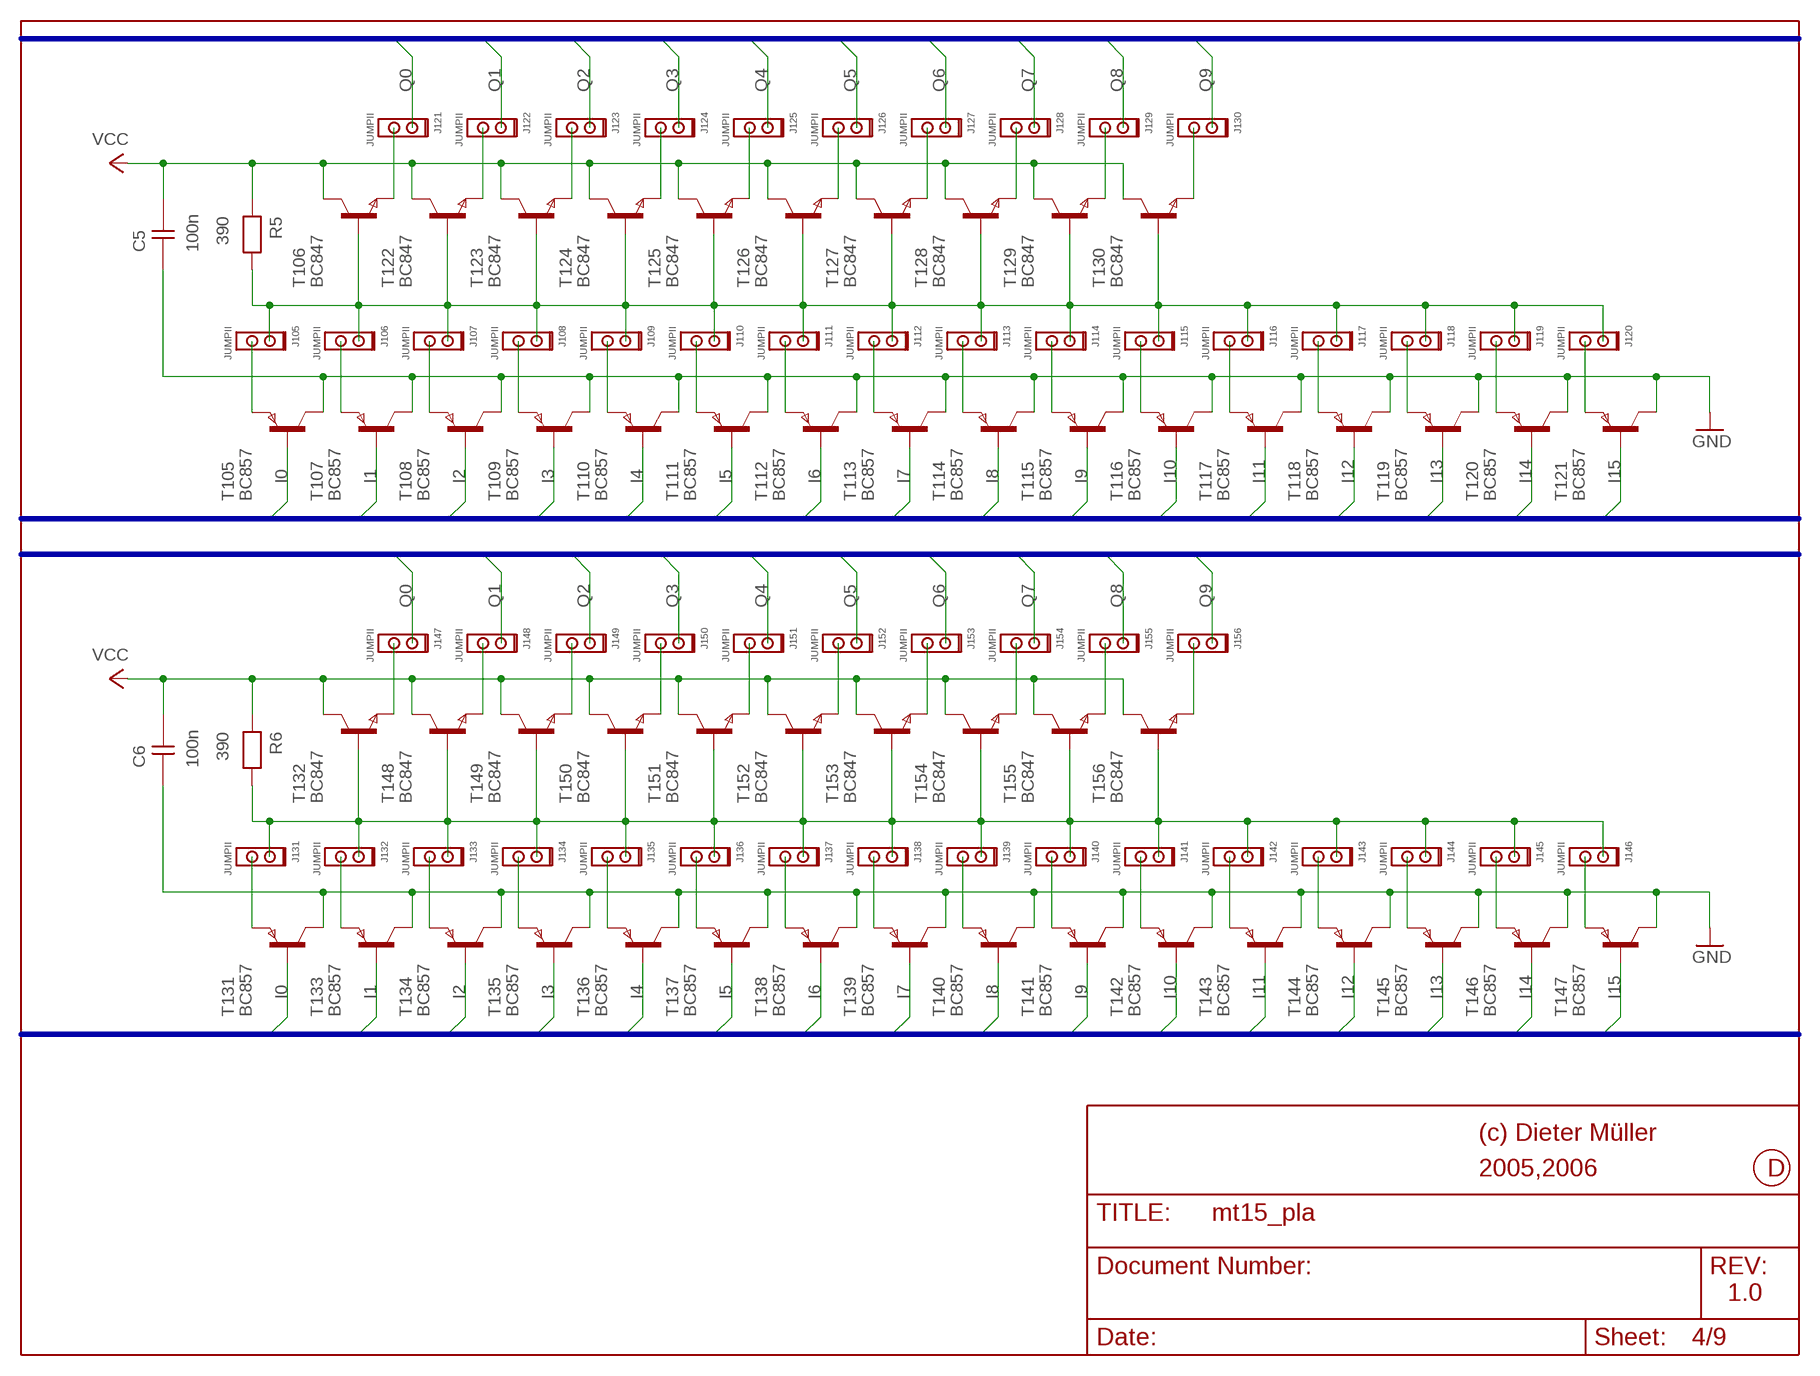
[diagram p3: schematic, sheet 4]

### Parts
C5  100n  CAPNP-5  [0204]
C6  100n  CAPNP-5  [0204]
J105  JUMPII  JUMPII@2  [JUMPII]
J106  JUMPII  JUMPII@2  [JUMPII]
J107  JUMPII  JUMPII@2  [JUMPII]
J108  JUMPII  JUMPII@2  [JUMPII]
J109  JUMPII  JUMPII@2  [JUMPII]
J110  JUMPII  JUMPII@2  [JUMPII]
J111  JUMPII  JUMPII@2  [JUMPII]
J112  JUMPII  JUMPII@2  [JUMPII]
J113  JUMPII  JUMPII@2  [JUMPII]
J114  JUMPII  JUMPII@2  [JUMPII]
J115  JUMPII  JUMPII@2  [JUMPII]
J116  JUMPII  JUMPII@2  [JUMPII]
J117  JUMPII  JUMPII@2  [JUMPII]
J118  JUMPII  JUMPII@2  [JUMPII]
J119  JUMPII  JUMPII@2  [JUMPII]
J120  JUMPII  JUMPII@2  [JUMPII]
J121  JUMPII  JUMPII@2  [JUMPII]
J122  JUMPII  JUMPII@2  [JUMPII]
J123  JUMPII  JUMPII@2  [JUMPII]
J124  JUMPII  JUMPII@2  [JUMPII]
J125  JUMPII  JUMPII@2  [JUMPII]
J126  JUMPII  JUMPII@2  [JUMPII]
J127  JUMPII  JUMPII@2  [JUMPII]
J128  JUMPII  JUMPII@2  [JUMPII]
J129  JUMPII  JUMPII@2  [JUMPII]
J130  JUMPII  JUMPII@2  [JUMPII]
J131  JUMPII  JUMPII@2  [JUMPII]
J132  JUMPII  JUMPII@2  [JUMPII]
J133  JUMPII  JUMPII@2  [JUMPII]
J134  JUMPII  JUMPII@2  [JUMPII]
J135  JUMPII  JUMPII@2  [JUMPII]
J136  JUMPII  JUMPII@2  [JUMPII]
J137  JUMPII  JUMPII@2  [JUMPII]
J138  JUMPII  JUMPII@2  [JUMPII]
J139  JUMPII  JUMPII@2  [JUMPII]
J140  JUMPII  JUMPII@2  [JUMPII]
J141  JUMPII  JUMPII@2  [JUMPII]
J142  JUMPII  JUMPII@2  [JUMPII]
J143  JUMPII  JUMPII@2  [JUMPII]
J144  JUMPII  JUMPII@2  [JUMPII]
J145  JUMPII  JUMPII@2  [JUMPII]
J146  JUMPII  JUMPII@2  [JUMPII]
J147  JUMPII  JUMPII@2  [JUMPII]
J148  JUMPII  JUMPII@2  [JUMPII]
J149  JUMPII  JUMPII@2  [JUMPII]
J150  JUMPII  JUMPII@2  [JUMPII]
J151  JUMPII  JUMPII@2  [JUMPII]
J152  JUMPII  JUMPII@2  [JUMPII]
J153  JUMPII  JUMPII@2  [JUMPII]
J154  JUMPII  JUMPII@2  [JUMPII]
J155  JUMPII  JUMPII@2  [JUMPII]
J156  JUMPII  JUMPII@2  [JUMPII]
R5  390  RESEU-7,5  [0204]
R6  390  RESEU-7,5  [0204]
T105  BC857  BC557  [SOT-23]
T106  BC847  BC547  [SOT-23]
T107  BC857  BC557  [SOT-23]
T108  BC857  BC557  [SOT-23]
T109  BC857  BC557  [SOT-23]
T110  BC857  BC557  [SOT-23]
T111  BC857  BC557  [SOT-23]
T112  BC857  BC557  [SOT-23]
T113  BC857  BC557  [SOT-23]
T114  BC857  BC557  [SOT-23]
T115  BC857  BC557  [SOT-23]
T116  BC857  BC557  [SOT-23]
T117  BC857  BC557  [SOT-23]
T118  BC857  BC557  [SOT-23]
T119  BC857  BC557  [SOT-23]
T120  BC857  BC557  [SOT-23]
T121  BC857  BC557  [SOT-23]
T122  BC847  BC547  [SOT-23]
T123  BC847  BC547  [SOT-23]
T124  BC847  BC547  [SOT-23]
T125  BC847  BC547  [SOT-23]
T126  BC847  BC547  [SOT-23]
T127  BC847  BC547  [SOT-23]
T128  BC847  BC547  [SOT-23]
T129  BC847  BC547  [SOT-23]
T130  BC847  BC547  [SOT-23]
T131  BC857  BC557  [SOT-23]
T132  BC847  BC547  [SOT-23]
T133  BC857  BC557  [SOT-23]
T134  BC857  BC557  [SOT-23]
T135  BC857  BC557  [SOT-23]
T136  BC857  BC557  [SOT-23]
T137  BC857  BC557  [SOT-23]
T138  BC857  BC557  [SOT-23]
T139  BC857  BC557  [SOT-23]
T140  BC857  BC557  [SOT-23]
T141  BC857  BC557  [SOT-23]
T142  BC857  BC557  [SOT-23]
T143  BC857  BC557  [SOT-23]
T144  BC857  BC557  [SOT-23]
T145  BC857  BC557  [SOT-23]
T146  BC857  BC557  [SOT-23]
T147  BC857  BC557  [SOT-23]
T148  BC847  BC547  [SOT-23]
T149  BC847  BC547  [SOT-23]
T150  BC847  BC547  [SOT-23]
T151  BC847  BC547  [SOT-23]
T152  BC847  BC547  [SOT-23]
T153  BC847  BC547  [SOT-23]
T154  BC847  BC547  [SOT-23]
T155  BC847  BC547  [SOT-23]
T156  BC847  BC547  [SOT-23]

### Nets
GND: C5.1 C6.1 T105.3(C) T107.3(C) T108.3(C) T109.3(C) T110.3(C) T111.3(C) T112.3(C) T113.3(C) T114.3(C) T115.3(C) T116.3(C) T117.3(C) T118.3(C) T119.3(C) T120.3(C) T121.3(C) T131.3(C) T133.3(C) T134.3(C) T135.3(C) T136.3(C) T137.3(C) T138.3(C) T139.3(C) T140.3(C) T141.3(C) T142.3(C) T143.3(C) T144.3(C) T145.3(C) T146.3(C) T147.3(C) ; also sheet 1,2,3,5,6,7,8,9
I0: T105.2(B) T131.2(B) ; also sheet 2,3,5,6,7,8,9
I1: T107.2(B) T133.2(B) ; also sheet 2,3,5,6,7,8,9
I2: T108.2(B) T134.2(B) ; also sheet 2,3,5,6,7,8,9
I3: T109.2(B) T135.2(B) ; also sheet 2,3,5,6,7,8,9
I4: T110.2(B) T136.2(B) ; also sheet 2,3,5,6,7,8,9
I5: T111.2(B) T137.2(B) ; also sheet 2,3,5,6,7,8,9
I6: T112.2(B) T138.2(B) ; also sheet 2,3,5,6,7,8,9
I7: T113.2(B) T139.2(B) ; also sheet 2,3,5,6,7,8,9
I8: T114.2(B) T140.2(B) ; also sheet 2,3,5,6,7,8,9
I9: T115.2(B) T141.2(B) ; also sheet 2,3,5,6,7,8,9
I10: T116.2(B) T142.2(B) ; also sheet 2,3,5,6,7,8,9
I11: T117.2(B) T143.2(B) ; also sheet 2,3,5,6,7,8,9
I12: T118.2(B) T144.2(B) ; also sheet 2,3,5,6,7,8,9
I13: T119.2(B) T145.2(B) ; also sheet 2,3,5,6,7,8,9
I14: T120.2(B) T146.2(B) ; also sheet 2,3,5,6,7,8,9
I15: T121.2(B) T147.2(B) ; also sheet 2,3,5,6,7,8,9
N$109: J105.2 T105.1(E)
N$110: J106.2 T107.1(E)
N$111: J107.2 T108.1(E)
N$112: J105.1 J106.1 J107.1 J108.1 J109.1 J110.1 J111.1 J112.1 J113.1 J114.1 J115.1 J116.1 J117.1 J118.1 J119.1 J120.1 R5.2 T106.2(B) T122.2(B) T123.2(B) T124.2(B) T125.2(B) T126.2(B) T127.2(B) T128.2(B) T129.2(B) T130.2(B)
N$113: J120.2 T121.1(E)
N$114: J119.2 T120.1(E)
N$115: J118.2 T119.1(E)
N$116: J117.2 T118.1(E)
N$117: J116.2 T117.1(E)
N$118: J110.2 T111.1(E)
N$119: J109.2 T110.1(E)
N$120: J108.2 T109.1(E)
N$121: J111.2 T112.1(E)
N$122: J112.2 T113.1(E)
N$123: J113.2 T114.1(E)
N$124: J114.2 T115.1(E)
N$125: J115.2 T116.1(E)
N$126: J130.2 T130.1(E)
N$127: J121.2 T106.1(E)
N$128: J122.2 T122.1(E)
N$129: J123.2 T123.1(E)
N$130: J124.2 T124.1(E)
N$131: J125.2 T125.1(E)
N$132: J126.2 T126.1(E)
N$133: J127.2 T127.1(E)
N$134: J128.2 T128.1(E)
N$135: J129.2 T129.1(E)
N$136: J131.2 T131.1(E)
N$137: J132.2 T133.1(E)
N$138: J133.2 T134.1(E)
N$139: J131.1 J132.1 J133.1 J134.1 J135.1 J136.1 J137.1 J138.1 J139.1 J140.1 J141.1 J142.1 J143.1 J144.1 J145.1 J146.1 R6.2 T132.2(B) T148.2(B) T149.2(B) T150.2(B) T151.2(B) T152.2(B) T153.2(B) T154.2(B) T155.2(B) T156.2(B)
N$140: J146.2 T147.1(E)
N$141: J145.2 T146.1(E)
N$142: J144.2 T145.1(E)
N$143: J143.2 T144.1(E)
N$144: J142.2 T143.1(E)
N$145: J136.2 T137.1(E)
N$146: J135.2 T136.1(E)
N$147: J134.2 T135.1(E)
N$148: J137.2 T138.1(E)
N$149: J138.2 T139.1(E)
N$150: J139.2 T140.1(E)
N$151: J140.2 T141.1(E)
N$152: J141.2 T142.1(E)
N$153: J156.2 T156.1(E)
N$154: J147.2 T132.1(E)
N$155: J148.2 T148.1(E)
N$156: J149.2 T149.1(E)
N$157: J150.2 T150.1(E)
N$158: J151.2 T151.1(E)
N$159: J152.2 T152.1(E)
N$160: J153.2 T153.1(E)
N$161: J154.2 T154.1(E)
N$162: J155.2 T155.1(E)
Q0: J121.1 J147.1 ; also sheet 2,3,5,6,7,8,9
Q1: J122.1 J148.1 ; also sheet 2,3,5,6,7,8,9
Q2: J123.1 J149.1 ; also sheet 2,3,5,6,7,8,9
Q3: J124.1 J150.1 ; also sheet 2,3,5,6,7,8,9
Q4: J125.1 J151.1 ; also sheet 2,3,5,6,7,8,9
Q5: J126.1 J152.1 ; also sheet 2,3,5,6,7,8,9
Q6: J127.1 J153.1 ; also sheet 2,3,5,6,7,8,9
Q7: J128.1 J154.1 ; also sheet 2,3,5,6,7,8,9
Q8: J129.1 J155.1 ; also sheet 2,3,5,6,7,8,9
Q9: J130.1 J156.1 ; also sheet 2,3,5,6,7,8,9
VCC: C5.2 C6.2 R5.1 R6.1 T106.3(C) T122.3(C) T123.3(C) T124.3(C) T125.3(C) T126.3(C) T127.3(C) T128.3(C) T129.3(C) T130.3(C) T132.3(C) T148.3(C) T149.3(C) T150.3(C) T151.3(C) T152.3(C) T153.3(C) T154.3(C) T155.3(C) T156.3(C) ; also sheet 1,2,3,5,6,7,8,9

### Buses
B$1
B$3

### Notes on the sheet
- (c) Dieter Müller
- 2005,2006 | D
- 1.0

## Sheet 5 of 9
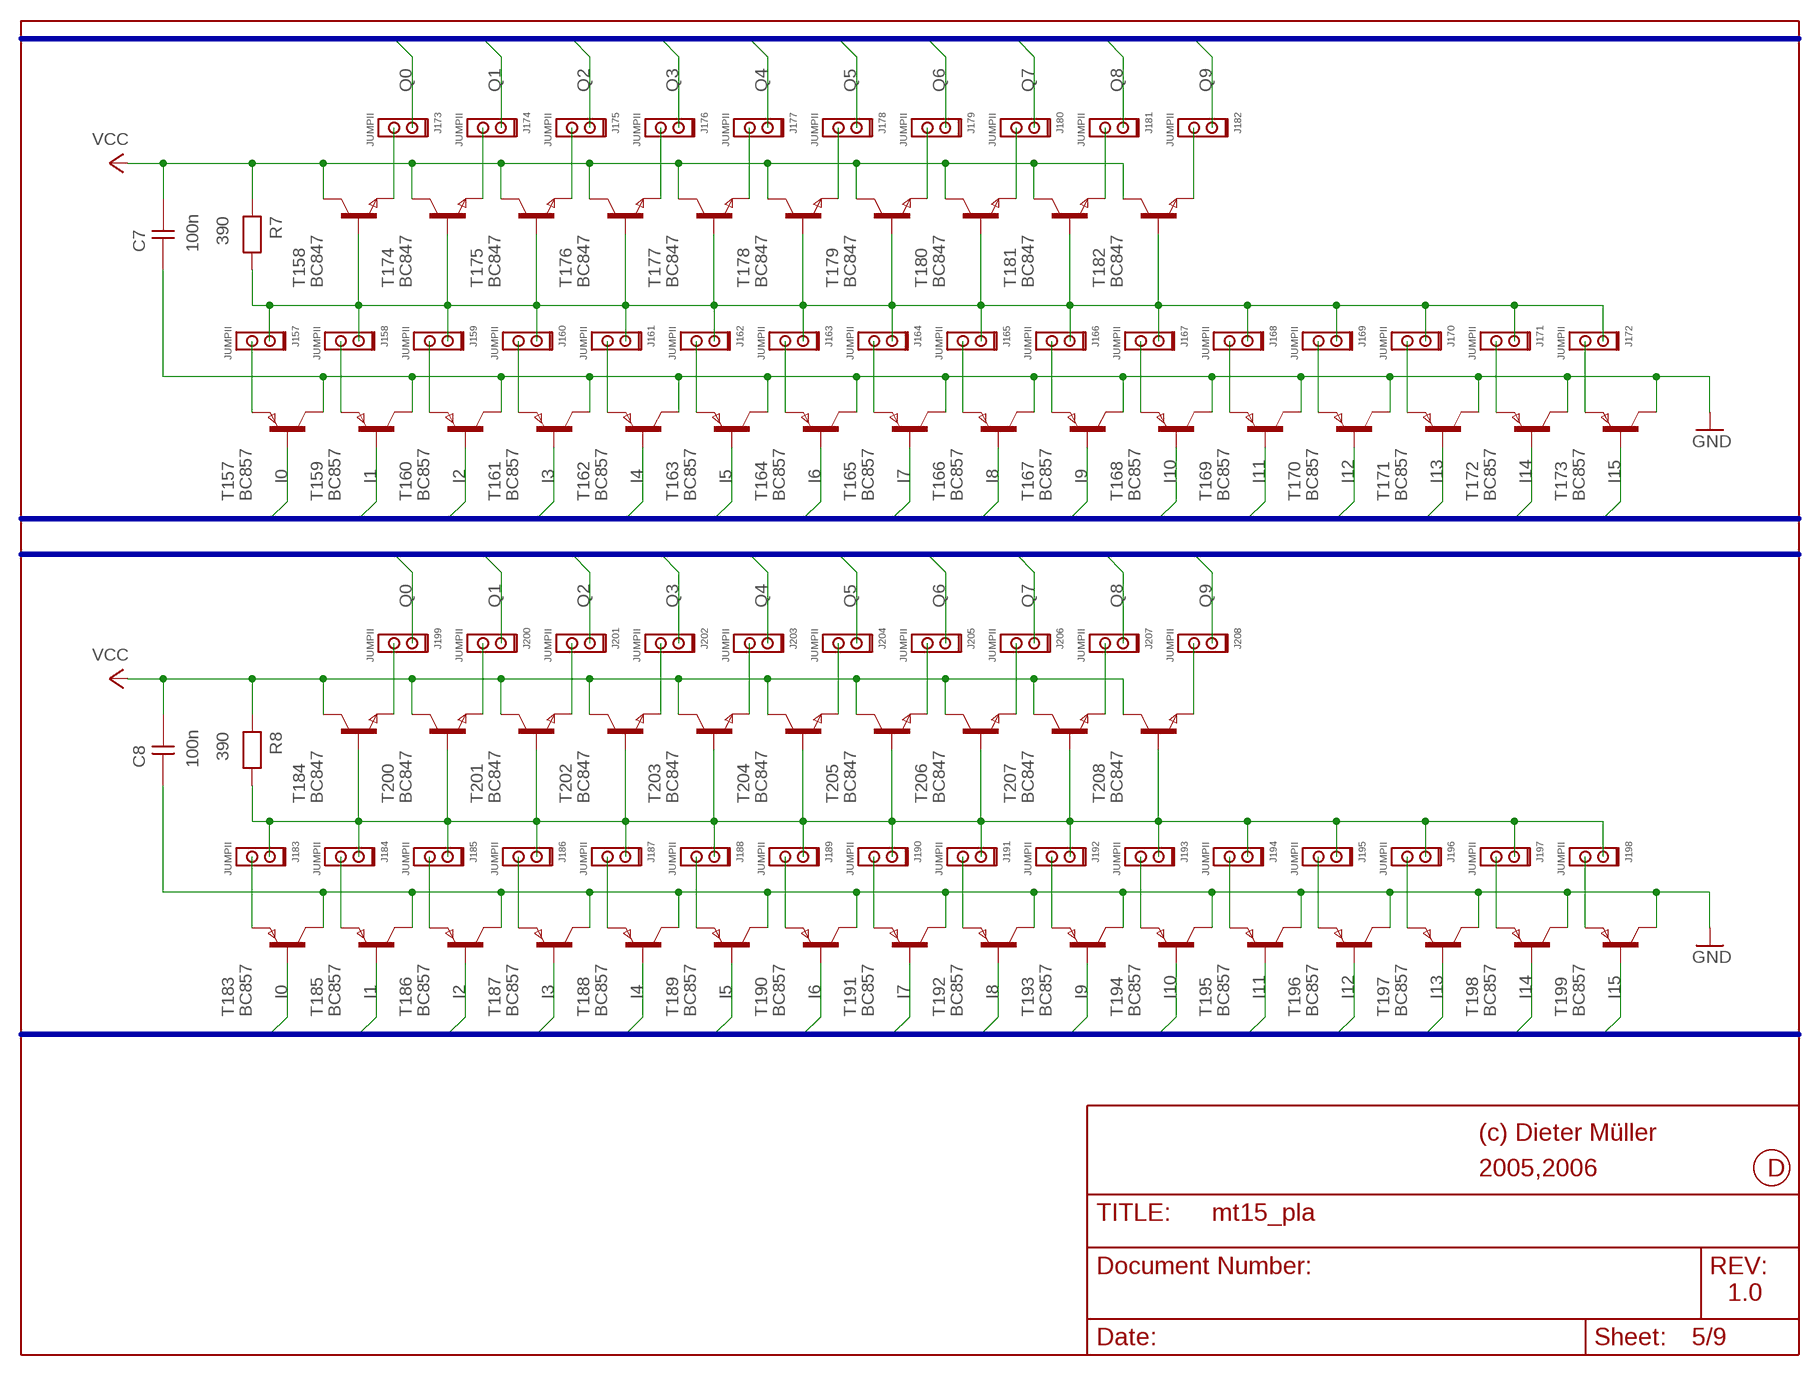
[diagram p4: schematic, sheet 5]

### Parts
C7  100n  CAPNP-5  [0204]
C8  100n  CAPNP-5  [0204]
J157  JUMPII  JUMPII@2  [JUMPII]
J158  JUMPII  JUMPII@2  [JUMPII]
J159  JUMPII  JUMPII@2  [JUMPII]
J160  JUMPII  JUMPII@2  [JUMPII]
J161  JUMPII  JUMPII@2  [JUMPII]
J162  JUMPII  JUMPII@2  [JUMPII]
J163  JUMPII  JUMPII@2  [JUMPII]
J164  JUMPII  JUMPII@2  [JUMPII]
J165  JUMPII  JUMPII@2  [JUMPII]
J166  JUMPII  JUMPII@2  [JUMPII]
J167  JUMPII  JUMPII@2  [JUMPII]
J168  JUMPII  JUMPII@2  [JUMPII]
J169  JUMPII  JUMPII@2  [JUMPII]
J170  JUMPII  JUMPII@2  [JUMPII]
J171  JUMPII  JUMPII@2  [JUMPII]
J172  JUMPII  JUMPII@2  [JUMPII]
J173  JUMPII  JUMPII@2  [JUMPII]
J174  JUMPII  JUMPII@2  [JUMPII]
J175  JUMPII  JUMPII@2  [JUMPII]
J176  JUMPII  JUMPII@2  [JUMPII]
J177  JUMPII  JUMPII@2  [JUMPII]
J178  JUMPII  JUMPII@2  [JUMPII]
J179  JUMPII  JUMPII@2  [JUMPII]
J180  JUMPII  JUMPII@2  [JUMPII]
J181  JUMPII  JUMPII@2  [JUMPII]
J182  JUMPII  JUMPII@2  [JUMPII]
J183  JUMPII  JUMPII@2  [JUMPII]
J184  JUMPII  JUMPII@2  [JUMPII]
J185  JUMPII  JUMPII@2  [JUMPII]
J186  JUMPII  JUMPII@2  [JUMPII]
J187  JUMPII  JUMPII@2  [JUMPII]
J188  JUMPII  JUMPII@2  [JUMPII]
J189  JUMPII  JUMPII@2  [JUMPII]
J190  JUMPII  JUMPII@2  [JUMPII]
J191  JUMPII  JUMPII@2  [JUMPII]
J192  JUMPII  JUMPII@2  [JUMPII]
J193  JUMPII  JUMPII@2  [JUMPII]
J194  JUMPII  JUMPII@2  [JUMPII]
J195  JUMPII  JUMPII@2  [JUMPII]
J196  JUMPII  JUMPII@2  [JUMPII]
J197  JUMPII  JUMPII@2  [JUMPII]
J198  JUMPII  JUMPII@2  [JUMPII]
J199  JUMPII  JUMPII@2  [JUMPII]
J200  JUMPII  JUMPII@2  [JUMPII]
J201  JUMPII  JUMPII@2  [JUMPII]
J202  JUMPII  JUMPII@2  [JUMPII]
J203  JUMPII  JUMPII@2  [JUMPII]
J204  JUMPII  JUMPII@2  [JUMPII]
J205  JUMPII  JUMPII@2  [JUMPII]
J206  JUMPII  JUMPII@2  [JUMPII]
J207  JUMPII  JUMPII@2  [JUMPII]
J208  JUMPII  JUMPII@2  [JUMPII]
R7  390  RESEU-7,5  [0204]
R8  390  RESEU-7,5  [0204]
T157  BC857  BC557  [SOT-23]
T158  BC847  BC547  [SOT-23]
T159  BC857  BC557  [SOT-23]
T160  BC857  BC557  [SOT-23]
T161  BC857  BC557  [SOT-23]
T162  BC857  BC557  [SOT-23]
T163  BC857  BC557  [SOT-23]
T164  BC857  BC557  [SOT-23]
T165  BC857  BC557  [SOT-23]
T166  BC857  BC557  [SOT-23]
T167  BC857  BC557  [SOT-23]
T168  BC857  BC557  [SOT-23]
T169  BC857  BC557  [SOT-23]
T170  BC857  BC557  [SOT-23]
T171  BC857  BC557  [SOT-23]
T172  BC857  BC557  [SOT-23]
T173  BC857  BC557  [SOT-23]
T174  BC847  BC547  [SOT-23]
T175  BC847  BC547  [SOT-23]
T176  BC847  BC547  [SOT-23]
T177  BC847  BC547  [SOT-23]
T178  BC847  BC547  [SOT-23]
T179  BC847  BC547  [SOT-23]
T180  BC847  BC547  [SOT-23]
T181  BC847  BC547  [SOT-23]
T182  BC847  BC547  [SOT-23]
T183  BC857  BC557  [SOT-23]
T184  BC847  BC547  [SOT-23]
T185  BC857  BC557  [SOT-23]
T186  BC857  BC557  [SOT-23]
T187  BC857  BC557  [SOT-23]
T188  BC857  BC557  [SOT-23]
T189  BC857  BC557  [SOT-23]
T190  BC857  BC557  [SOT-23]
T191  BC857  BC557  [SOT-23]
T192  BC857  BC557  [SOT-23]
T193  BC857  BC557  [SOT-23]
T194  BC857  BC557  [SOT-23]
T195  BC857  BC557  [SOT-23]
T196  BC857  BC557  [SOT-23]
T197  BC857  BC557  [SOT-23]
T198  BC857  BC557  [SOT-23]
T199  BC857  BC557  [SOT-23]
T200  BC847  BC547  [SOT-23]
T201  BC847  BC547  [SOT-23]
T202  BC847  BC547  [SOT-23]
T203  BC847  BC547  [SOT-23]
T204  BC847  BC547  [SOT-23]
T205  BC847  BC547  [SOT-23]
T206  BC847  BC547  [SOT-23]
T207  BC847  BC547  [SOT-23]
T208  BC847  BC547  [SOT-23]

### Nets
GND: C7.1 C8.1 T157.3(C) T159.3(C) T160.3(C) T161.3(C) T162.3(C) T163.3(C) T164.3(C) T165.3(C) T166.3(C) T167.3(C) T168.3(C) T169.3(C) T170.3(C) T171.3(C) T172.3(C) T173.3(C) T183.3(C) T185.3(C) T186.3(C) T187.3(C) T188.3(C) T189.3(C) T190.3(C) T191.3(C) T192.3(C) T193.3(C) T194.3(C) T195.3(C) T196.3(C) T197.3(C) T198.3(C) T199.3(C) ; also sheet 1,2,3,4,6,7,8,9
I0: T157.2(B) T183.2(B) ; also sheet 2,3,4,6,7,8,9
I1: T159.2(B) T185.2(B) ; also sheet 2,3,4,6,7,8,9
I2: T160.2(B) T186.2(B) ; also sheet 2,3,4,6,7,8,9
I3: T161.2(B) T187.2(B) ; also sheet 2,3,4,6,7,8,9
I4: T162.2(B) T188.2(B) ; also sheet 2,3,4,6,7,8,9
I5: T163.2(B) T189.2(B) ; also sheet 2,3,4,6,7,8,9
I6: T164.2(B) T190.2(B) ; also sheet 2,3,4,6,7,8,9
I7: T165.2(B) T191.2(B) ; also sheet 2,3,4,6,7,8,9
I8: T166.2(B) T192.2(B) ; also sheet 2,3,4,6,7,8,9
I9: T167.2(B) T193.2(B) ; also sheet 2,3,4,6,7,8,9
I10: T168.2(B) T194.2(B) ; also sheet 2,3,4,6,7,8,9
I11: T169.2(B) T195.2(B) ; also sheet 2,3,4,6,7,8,9
I12: T170.2(B) T196.2(B) ; also sheet 2,3,4,6,7,8,9
I13: T171.2(B) T197.2(B) ; also sheet 2,3,4,6,7,8,9
I14: T172.2(B) T198.2(B) ; also sheet 2,3,4,6,7,8,9
I15: T173.2(B) T199.2(B) ; also sheet 2,3,4,6,7,8,9
N$163: J157.2 T157.1(E)
N$164: J158.2 T159.1(E)
N$165: J159.2 T160.1(E)
N$166: J157.1 J158.1 J159.1 J160.1 J161.1 J162.1 J163.1 J164.1 J165.1 J166.1 J167.1 J168.1 J169.1 J170.1 J171.1 J172.1 R7.2 T158.2(B) T174.2(B) T175.2(B) T176.2(B) T177.2(B) T178.2(B) T179.2(B) T180.2(B) T181.2(B) T182.2(B)
N$167: J172.2 T173.1(E)
N$168: J171.2 T172.1(E)
N$169: J170.2 T171.1(E)
N$170: J169.2 T170.1(E)
N$171: J168.2 T169.1(E)
N$172: J162.2 T163.1(E)
N$173: J161.2 T162.1(E)
N$174: J160.2 T161.1(E)
N$175: J163.2 T164.1(E)
N$176: J164.2 T165.1(E)
N$177: J165.2 T166.1(E)
N$178: J166.2 T167.1(E)
N$179: J167.2 T168.1(E)
N$180: J182.2 T182.1(E)
N$181: J173.2 T158.1(E)
N$182: J174.2 T174.1(E)
N$183: J175.2 T175.1(E)
N$184: J176.2 T176.1(E)
N$185: J177.2 T177.1(E)
N$186: J178.2 T178.1(E)
N$187: J179.2 T179.1(E)
N$188: J180.2 T180.1(E)
N$189: J181.2 T181.1(E)
N$190: J183.2 T183.1(E)
N$191: J184.2 T185.1(E)
N$192: J185.2 T186.1(E)
N$193: J183.1 J184.1 J185.1 J186.1 J187.1 J188.1 J189.1 J190.1 J191.1 J192.1 J193.1 J194.1 J195.1 J196.1 J197.1 J198.1 R8.2 T184.2(B) T200.2(B) T201.2(B) T202.2(B) T203.2(B) T204.2(B) T205.2(B) T206.2(B) T207.2(B) T208.2(B)
N$194: J198.2 T199.1(E)
N$195: J197.2 T198.1(E)
N$196: J196.2 T197.1(E)
N$197: J195.2 T196.1(E)
N$198: J194.2 T195.1(E)
N$199: J188.2 T189.1(E)
N$200: J187.2 T188.1(E)
N$201: J186.2 T187.1(E)
N$202: J189.2 T190.1(E)
N$203: J190.2 T191.1(E)
N$204: J191.2 T192.1(E)
N$205: J192.2 T193.1(E)
N$206: J193.2 T194.1(E)
N$207: J208.2 T208.1(E)
N$208: J199.2 T184.1(E)
N$209: J200.2 T200.1(E)
N$210: J201.2 T201.1(E)
N$211: J202.2 T202.1(E)
N$212: J203.2 T203.1(E)
N$213: J204.2 T204.1(E)
N$214: J205.2 T205.1(E)
N$215: J206.2 T206.1(E)
N$216: J207.2 T207.1(E)
Q0: J173.1 J199.1 ; also sheet 2,3,4,6,7,8,9
Q1: J174.1 J200.1 ; also sheet 2,3,4,6,7,8,9
Q2: J175.1 J201.1 ; also sheet 2,3,4,6,7,8,9
Q3: J176.1 J202.1 ; also sheet 2,3,4,6,7,8,9
Q4: J177.1 J203.1 ; also sheet 2,3,4,6,7,8,9
Q5: J178.1 J204.1 ; also sheet 2,3,4,6,7,8,9
Q6: J179.1 J205.1 ; also sheet 2,3,4,6,7,8,9
Q7: J180.1 J206.1 ; also sheet 2,3,4,6,7,8,9
Q8: J181.1 J207.1 ; also sheet 2,3,4,6,7,8,9
Q9: J182.1 J208.1 ; also sheet 2,3,4,6,7,8,9
VCC: C7.2 C8.2 R7.1 R8.1 T158.3(C) T174.3(C) T175.3(C) T176.3(C) T177.3(C) T178.3(C) T179.3(C) T180.3(C) T181.3(C) T182.3(C) T184.3(C) T200.3(C) T201.3(C) T202.3(C) T203.3(C) T204.3(C) T205.3(C) T206.3(C) T207.3(C) T208.3(C) ; also sheet 1,2,3,4,6,7,8,9

### Buses
B$1
B$3

### Notes on the sheet
- (c) Dieter Müller
- 2005,2006 | D
- 1.0

## Sheet 6 of 9
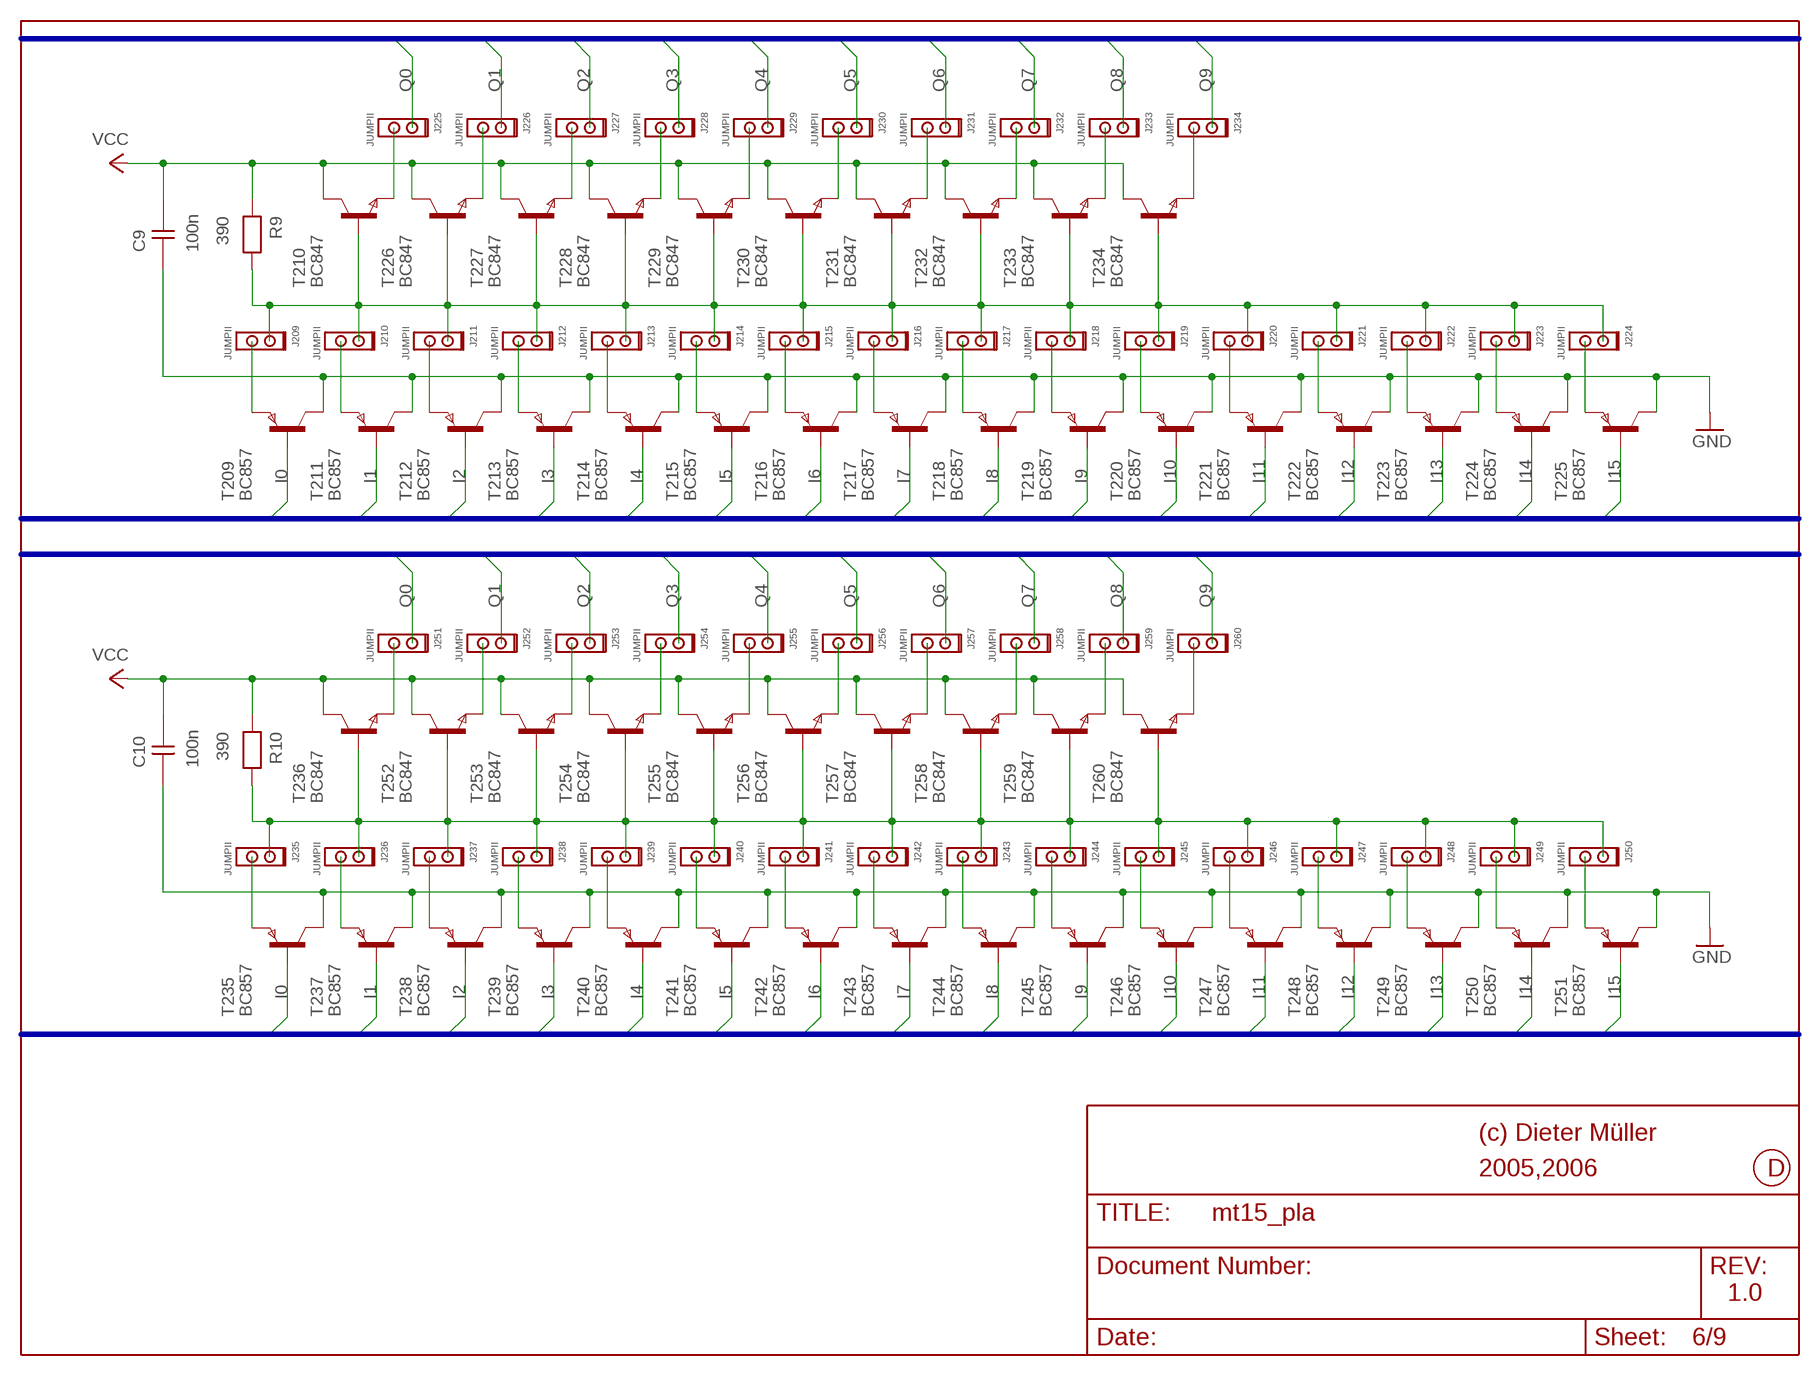
[diagram p5: schematic, sheet 6]

### Parts
C9  100n  CAPNP-5  [0204]
C10  100n  CAPNP-5  [0204]
J209  JUMPII  JUMPII@2  [JUMPII]
J210  JUMPII  JUMPII@2  [JUMPII]
J211  JUMPII  JUMPII@2  [JUMPII]
J212  JUMPII  JUMPII@2  [JUMPII]
J213  JUMPII  JUMPII@2  [JUMPII]
J214  JUMPII  JUMPII@2  [JUMPII]
J215  JUMPII  JUMPII@2  [JUMPII]
J216  JUMPII  JUMPII@2  [JUMPII]
J217  JUMPII  JUMPII@2  [JUMPII]
J218  JUMPII  JUMPII@2  [JUMPII]
J219  JUMPII  JUMPII@2  [JUMPII]
J220  JUMPII  JUMPII@2  [JUMPII]
J221  JUMPII  JUMPII@2  [JUMPII]
J222  JUMPII  JUMPII@2  [JUMPII]
J223  JUMPII  JUMPII@2  [JUMPII]
J224  JUMPII  JUMPII@2  [JUMPII]
J225  JUMPII  JUMPII@2  [JUMPII]
J226  JUMPII  JUMPII@2  [JUMPII]
J227  JUMPII  JUMPII@2  [JUMPII]
J228  JUMPII  JUMPII@2  [JUMPII]
J229  JUMPII  JUMPII@2  [JUMPII]
J230  JUMPII  JUMPII@2  [JUMPII]
J231  JUMPII  JUMPII@2  [JUMPII]
J232  JUMPII  JUMPII@2  [JUMPII]
J233  JUMPII  JUMPII@2  [JUMPII]
J234  JUMPII  JUMPII@2  [JUMPII]
J235  JUMPII  JUMPII@2  [JUMPII]
J236  JUMPII  JUMPII@2  [JUMPII]
J237  JUMPII  JUMPII@2  [JUMPII]
J238  JUMPII  JUMPII@2  [JUMPII]
J239  JUMPII  JUMPII@2  [JUMPII]
J240  JUMPII  JUMPII@2  [JUMPII]
J241  JUMPII  JUMPII@2  [JUMPII]
J242  JUMPII  JUMPII@2  [JUMPII]
J243  JUMPII  JUMPII@2  [JUMPII]
J244  JUMPII  JUMPII@2  [JUMPII]
J245  JUMPII  JUMPII@2  [JUMPII]
J246  JUMPII  JUMPII@2  [JUMPII]
J247  JUMPII  JUMPII@2  [JUMPII]
J248  JUMPII  JUMPII@2  [JUMPII]
J249  JUMPII  JUMPII@2  [JUMPII]
J250  JUMPII  JUMPII@2  [JUMPII]
J251  JUMPII  JUMPII@2  [JUMPII]
J252  JUMPII  JUMPII@2  [JUMPII]
J253  JUMPII  JUMPII@2  [JUMPII]
J254  JUMPII  JUMPII@2  [JUMPII]
J255  JUMPII  JUMPII@2  [JUMPII]
J256  JUMPII  JUMPII@2  [JUMPII]
J257  JUMPII  JUMPII@2  [JUMPII]
J258  JUMPII  JUMPII@2  [JUMPII]
J259  JUMPII  JUMPII@2  [JUMPII]
J260  JUMPII  JUMPII@2  [JUMPII]
R9  390  RESEU-7,5  [0204]
R10  390  RESEU-7,5  [0204]
T209  BC857  BC557  [SOT-23]
T210  BC847  BC547  [SOT-23]
T211  BC857  BC557  [SOT-23]
T212  BC857  BC557  [SOT-23]
T213  BC857  BC557  [SOT-23]
T214  BC857  BC557  [SOT-23]
T215  BC857  BC557  [SOT-23]
T216  BC857  BC557  [SOT-23]
T217  BC857  BC557  [SOT-23]
T218  BC857  BC557  [SOT-23]
T219  BC857  BC557  [SOT-23]
T220  BC857  BC557  [SOT-23]
T221  BC857  BC557  [SOT-23]
T222  BC857  BC557  [SOT-23]
T223  BC857  BC557  [SOT-23]
T224  BC857  BC557  [SOT-23]
T225  BC857  BC557  [SOT-23]
T226  BC847  BC547  [SOT-23]
T227  BC847  BC547  [SOT-23]
T228  BC847  BC547  [SOT-23]
T229  BC847  BC547  [SOT-23]
T230  BC847  BC547  [SOT-23]
T231  BC847  BC547  [SOT-23]
T232  BC847  BC547  [SOT-23]
T233  BC847  BC547  [SOT-23]
T234  BC847  BC547  [SOT-23]
T235  BC857  BC557  [SOT-23]
T236  BC847  BC547  [SOT-23]
T237  BC857  BC557  [SOT-23]
T238  BC857  BC557  [SOT-23]
T239  BC857  BC557  [SOT-23]
T240  BC857  BC557  [SOT-23]
T241  BC857  BC557  [SOT-23]
T242  BC857  BC557  [SOT-23]
T243  BC857  BC557  [SOT-23]
T244  BC857  BC557  [SOT-23]
T245  BC857  BC557  [SOT-23]
T246  BC857  BC557  [SOT-23]
T247  BC857  BC557  [SOT-23]
T248  BC857  BC557  [SOT-23]
T249  BC857  BC557  [SOT-23]
T250  BC857  BC557  [SOT-23]
T251  BC857  BC557  [SOT-23]
T252  BC847  BC547  [SOT-23]
T253  BC847  BC547  [SOT-23]
T254  BC847  BC547  [SOT-23]
T255  BC847  BC547  [SOT-23]
T256  BC847  BC547  [SOT-23]
T257  BC847  BC547  [SOT-23]
T258  BC847  BC547  [SOT-23]
T259  BC847  BC547  [SOT-23]
T260  BC847  BC547  [SOT-23]

### Nets
GND: C9.1 C10.1 T209.3(C) T211.3(C) T212.3(C) T213.3(C) T214.3(C) T215.3(C) T216.3(C) T217.3(C) T218.3(C) T219.3(C) T220.3(C) T221.3(C) T222.3(C) T223.3(C) T224.3(C) T225.3(C) T235.3(C) T237.3(C) T238.3(C) T239.3(C) T240.3(C) T241.3(C) T242.3(C) T243.3(C) T244.3(C) T245.3(C) T246.3(C) T247.3(C) T248.3(C) T249.3(C) T250.3(C) T251.3(C) ; also sheet 1,2,3,4,5,7,8,9
I0: T209.2(B) T235.2(B) ; also sheet 2,3,4,5,7,8,9
I1: T211.2(B) T237.2(B) ; also sheet 2,3,4,5,7,8,9
I2: T212.2(B) T238.2(B) ; also sheet 2,3,4,5,7,8,9
I3: T213.2(B) T239.2(B) ; also sheet 2,3,4,5,7,8,9
I4: T214.2(B) T240.2(B) ; also sheet 2,3,4,5,7,8,9
I5: T215.2(B) T241.2(B) ; also sheet 2,3,4,5,7,8,9
I6: T216.2(B) T242.2(B) ; also sheet 2,3,4,5,7,8,9
I7: T217.2(B) T243.2(B) ; also sheet 2,3,4,5,7,8,9
I8: T218.2(B) T244.2(B) ; also sheet 2,3,4,5,7,8,9
I9: T219.2(B) T245.2(B) ; also sheet 2,3,4,5,7,8,9
I10: T220.2(B) T246.2(B) ; also sheet 2,3,4,5,7,8,9
I11: T221.2(B) T247.2(B) ; also sheet 2,3,4,5,7,8,9
I12: T222.2(B) T248.2(B) ; also sheet 2,3,4,5,7,8,9
I13: T223.2(B) T249.2(B) ; also sheet 2,3,4,5,7,8,9
I14: T224.2(B) T250.2(B) ; also sheet 2,3,4,5,7,8,9
I15: T225.2(B) T251.2(B) ; also sheet 2,3,4,5,7,8,9
N$217: J209.2 T209.1(E)
N$218: J210.2 T211.1(E)
N$219: J211.2 T212.1(E)
N$220: J209.1 J210.1 J211.1 J212.1 J213.1 J214.1 J215.1 J216.1 J217.1 J218.1 J219.1 J220.1 J221.1 J222.1 J223.1 J224.1 R9.2 T210.2(B) T226.2(B) T227.2(B) T228.2(B) T229.2(B) T230.2(B) T231.2(B) T232.2(B) T233.2(B) T234.2(B)
N$221: J224.2 T225.1(E)
N$222: J223.2 T224.1(E)
N$223: J222.2 T223.1(E)
N$224: J221.2 T222.1(E)
N$225: J220.2 T221.1(E)
N$226: J214.2 T215.1(E)
N$227: J213.2 T214.1(E)
N$228: J212.2 T213.1(E)
N$229: J215.2 T216.1(E)
N$230: J216.2 T217.1(E)
N$231: J217.2 T218.1(E)
N$232: J218.2 T219.1(E)
N$233: J219.2 T220.1(E)
N$234: J234.2 T234.1(E)
N$235: J225.2 T210.1(E)
N$236: J226.2 T226.1(E)
N$237: J227.2 T227.1(E)
N$238: J228.2 T228.1(E)
N$239: J229.2 T229.1(E)
N$240: J230.2 T230.1(E)
N$241: J231.2 T231.1(E)
N$242: J232.2 T232.1(E)
N$243: J233.2 T233.1(E)
N$244: J235.2 T235.1(E)
N$245: J236.2 T237.1(E)
N$246: J237.2 T238.1(E)
N$247: J235.1 J236.1 J237.1 J238.1 J239.1 J240.1 J241.1 J242.1 J243.1 J244.1 J245.1 J246.1 J247.1 J248.1 J249.1 J250.1 R10.2 T236.2(B) T252.2(B) T253.2(B) T254.2(B) T255.2(B) T256.2(B) T257.2(B) T258.2(B) T259.2(B) T260.2(B)
N$248: J250.2 T251.1(E)
N$249: J249.2 T250.1(E)
N$250: J248.2 T249.1(E)
N$251: J247.2 T248.1(E)
N$252: J246.2 T247.1(E)
N$253: J240.2 T241.1(E)
N$254: J239.2 T240.1(E)
N$255: J238.2 T239.1(E)
N$256: J241.2 T242.1(E)
N$257: J242.2 T243.1(E)
N$258: J243.2 T244.1(E)
N$259: J244.2 T245.1(E)
N$260: J245.2 T246.1(E)
N$261: J260.2 T260.1(E)
N$262: J251.2 T236.1(E)
N$263: J252.2 T252.1(E)
N$264: J253.2 T253.1(E)
N$265: J254.2 T254.1(E)
N$266: J255.2 T255.1(E)
N$267: J256.2 T256.1(E)
N$268: J257.2 T257.1(E)
N$269: J258.2 T258.1(E)
N$270: J259.2 T259.1(E)
Q0: J225.1 J251.1 ; also sheet 2,3,4,5,7,8,9
Q1: J226.1 J252.1 ; also sheet 2,3,4,5,7,8,9
Q2: J227.1 J253.1 ; also sheet 2,3,4,5,7,8,9
Q3: J228.1 J254.1 ; also sheet 2,3,4,5,7,8,9
Q4: J229.1 J255.1 ; also sheet 2,3,4,5,7,8,9
Q5: J230.1 J256.1 ; also sheet 2,3,4,5,7,8,9
Q6: J231.1 J257.1 ; also sheet 2,3,4,5,7,8,9
Q7: J232.1 J258.1 ; also sheet 2,3,4,5,7,8,9
Q8: J233.1 J259.1 ; also sheet 2,3,4,5,7,8,9
Q9: J234.1 J260.1 ; also sheet 2,3,4,5,7,8,9
VCC: C9.2 C10.2 R9.1 R10.1 T210.3(C) T226.3(C) T227.3(C) T228.3(C) T229.3(C) T230.3(C) T231.3(C) T232.3(C) T233.3(C) T234.3(C) T236.3(C) T252.3(C) T253.3(C) T254.3(C) T255.3(C) T256.3(C) T257.3(C) T258.3(C) T259.3(C) T260.3(C) ; also sheet 1,2,3,4,5,7,8,9

### Buses
B$1
B$3

### Notes on the sheet
- (c) Dieter Müller
- 2005,2006 | D
- 1.0

## Sheet 7 of 9
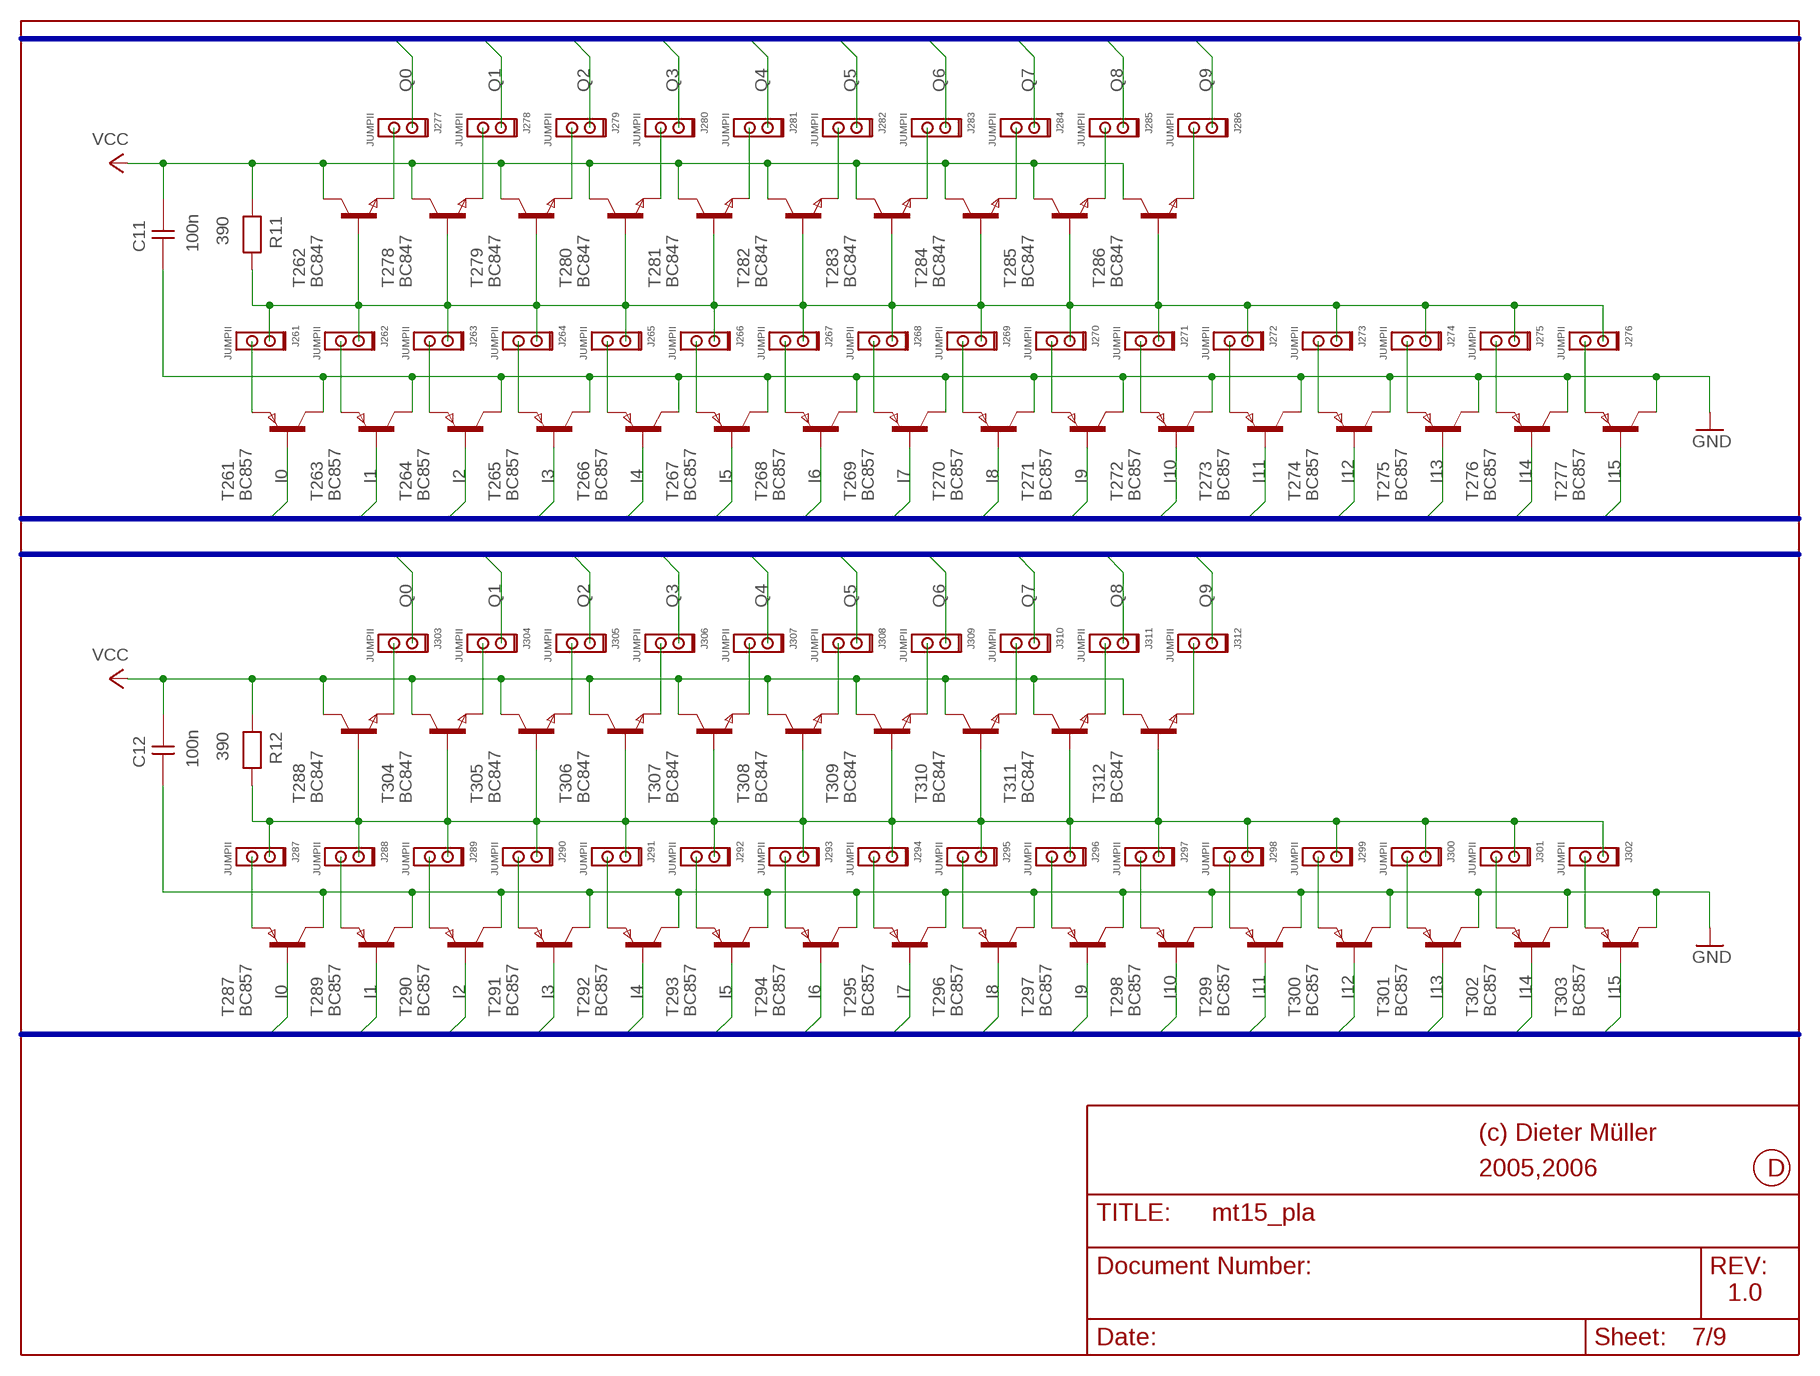
[diagram p6: schematic, sheet 7]

### Parts
C11  100n  CAPNP-5  [0204]
C12  100n  CAPNP-5  [0204]
J261  JUMPII  JUMPII@2  [JUMPII]
J262  JUMPII  JUMPII@2  [JUMPII]
J263  JUMPII  JUMPII@2  [JUMPII]
J264  JUMPII  JUMPII@2  [JUMPII]
J265  JUMPII  JUMPII@2  [JUMPII]
J266  JUMPII  JUMPII@2  [JUMPII]
J267  JUMPII  JUMPII@2  [JUMPII]
J268  JUMPII  JUMPII@2  [JUMPII]
J269  JUMPII  JUMPII@2  [JUMPII]
J270  JUMPII  JUMPII@2  [JUMPII]
J271  JUMPII  JUMPII@2  [JUMPII]
J272  JUMPII  JUMPII@2  [JUMPII]
J273  JUMPII  JUMPII@2  [JUMPII]
J274  JUMPII  JUMPII@2  [JUMPII]
J275  JUMPII  JUMPII@2  [JUMPII]
J276  JUMPII  JUMPII@2  [JUMPII]
J277  JUMPII  JUMPII@2  [JUMPII]
J278  JUMPII  JUMPII@2  [JUMPII]
J279  JUMPII  JUMPII@2  [JUMPII]
J280  JUMPII  JUMPII@2  [JUMPII]
J281  JUMPII  JUMPII@2  [JUMPII]
J282  JUMPII  JUMPII@2  [JUMPII]
J283  JUMPII  JUMPII@2  [JUMPII]
J284  JUMPII  JUMPII@2  [JUMPII]
J285  JUMPII  JUMPII@2  [JUMPII]
J286  JUMPII  JUMPII@2  [JUMPII]
J287  JUMPII  JUMPII@2  [JUMPII]
J288  JUMPII  JUMPII@2  [JUMPII]
J289  JUMPII  JUMPII@2  [JUMPII]
J290  JUMPII  JUMPII@2  [JUMPII]
J291  JUMPII  JUMPII@2  [JUMPII]
J292  JUMPII  JUMPII@2  [JUMPII]
J293  JUMPII  JUMPII@2  [JUMPII]
J294  JUMPII  JUMPII@2  [JUMPII]
J295  JUMPII  JUMPII@2  [JUMPII]
J296  JUMPII  JUMPII@2  [JUMPII]
J297  JUMPII  JUMPII@2  [JUMPII]
J298  JUMPII  JUMPII@2  [JUMPII]
J299  JUMPII  JUMPII@2  [JUMPII]
J300  JUMPII  JUMPII@2  [JUMPII]
J301  JUMPII  JUMPII@2  [JUMPII]
J302  JUMPII  JUMPII@2  [JUMPII]
J303  JUMPII  JUMPII@2  [JUMPII]
J304  JUMPII  JUMPII@2  [JUMPII]
J305  JUMPII  JUMPII@2  [JUMPII]
J306  JUMPII  JUMPII@2  [JUMPII]
J307  JUMPII  JUMPII@2  [JUMPII]
J308  JUMPII  JUMPII@2  [JUMPII]
J309  JUMPII  JUMPII@2  [JUMPII]
J310  JUMPII  JUMPII@2  [JUMPII]
J311  JUMPII  JUMPII@2  [JUMPII]
J312  JUMPII  JUMPII@2  [JUMPII]
R11  390  RESEU-7,5  [0204]
R12  390  RESEU-7,5  [0204]
T261  BC857  BC557  [SOT-23]
T262  BC847  BC547  [SOT-23]
T263  BC857  BC557  [SOT-23]
T264  BC857  BC557  [SOT-23]
T265  BC857  BC557  [SOT-23]
T266  BC857  BC557  [SOT-23]
T267  BC857  BC557  [SOT-23]
T268  BC857  BC557  [SOT-23]
T269  BC857  BC557  [SOT-23]
T270  BC857  BC557  [SOT-23]
T271  BC857  BC557  [SOT-23]
T272  BC857  BC557  [SOT-23]
T273  BC857  BC557  [SOT-23]
T274  BC857  BC557  [SOT-23]
T275  BC857  BC557  [SOT-23]
T276  BC857  BC557  [SOT-23]
T277  BC857  BC557  [SOT-23]
T278  BC847  BC547  [SOT-23]
T279  BC847  BC547  [SOT-23]
T280  BC847  BC547  [SOT-23]
T281  BC847  BC547  [SOT-23]
T282  BC847  BC547  [SOT-23]
T283  BC847  BC547  [SOT-23]
T284  BC847  BC547  [SOT-23]
T285  BC847  BC547  [SOT-23]
T286  BC847  BC547  [SOT-23]
T287  BC857  BC557  [SOT-23]
T288  BC847  BC547  [SOT-23]
T289  BC857  BC557  [SOT-23]
T290  BC857  BC557  [SOT-23]
T291  BC857  BC557  [SOT-23]
T292  BC857  BC557  [SOT-23]
T293  BC857  BC557  [SOT-23]
T294  BC857  BC557  [SOT-23]
T295  BC857  BC557  [SOT-23]
T296  BC857  BC557  [SOT-23]
T297  BC857  BC557  [SOT-23]
T298  BC857  BC557  [SOT-23]
T299  BC857  BC557  [SOT-23]
T300  BC857  BC557  [SOT-23]
T301  BC857  BC557  [SOT-23]
T302  BC857  BC557  [SOT-23]
T303  BC857  BC557  [SOT-23]
T304  BC847  BC547  [SOT-23]
T305  BC847  BC547  [SOT-23]
T306  BC847  BC547  [SOT-23]
T307  BC847  BC547  [SOT-23]
T308  BC847  BC547  [SOT-23]
T309  BC847  BC547  [SOT-23]
T310  BC847  BC547  [SOT-23]
T311  BC847  BC547  [SOT-23]
T312  BC847  BC547  [SOT-23]

### Nets
GND: C11.1 C12.1 T261.3(C) T263.3(C) T264.3(C) T265.3(C) T266.3(C) T267.3(C) T268.3(C) T269.3(C) T270.3(C) T271.3(C) T272.3(C) T273.3(C) T274.3(C) T275.3(C) T276.3(C) T277.3(C) T287.3(C) T289.3(C) T290.3(C) T291.3(C) T292.3(C) T293.3(C) T294.3(C) T295.3(C) T296.3(C) T297.3(C) T298.3(C) T299.3(C) T300.3(C) T301.3(C) T302.3(C) T303.3(C) ; also sheet 1,2,3,4,5,6,8,9
I0: T261.2(B) T287.2(B) ; also sheet 2,3,4,5,6,8,9
I1: T263.2(B) T289.2(B) ; also sheet 2,3,4,5,6,8,9
I2: T264.2(B) T290.2(B) ; also sheet 2,3,4,5,6,8,9
I3: T265.2(B) T291.2(B) ; also sheet 2,3,4,5,6,8,9
I4: T266.2(B) T292.2(B) ; also sheet 2,3,4,5,6,8,9
I5: T267.2(B) T293.2(B) ; also sheet 2,3,4,5,6,8,9
I6: T268.2(B) T294.2(B) ; also sheet 2,3,4,5,6,8,9
I7: T269.2(B) T295.2(B) ; also sheet 2,3,4,5,6,8,9
I8: T270.2(B) T296.2(B) ; also sheet 2,3,4,5,6,8,9
I9: T271.2(B) T297.2(B) ; also sheet 2,3,4,5,6,8,9
I10: T272.2(B) T298.2(B) ; also sheet 2,3,4,5,6,8,9
I11: T273.2(B) T299.2(B) ; also sheet 2,3,4,5,6,8,9
I12: T274.2(B) T300.2(B) ; also sheet 2,3,4,5,6,8,9
I13: T275.2(B) T301.2(B) ; also sheet 2,3,4,5,6,8,9
I14: T276.2(B) T302.2(B) ; also sheet 2,3,4,5,6,8,9
I15: T277.2(B) T303.2(B) ; also sheet 2,3,4,5,6,8,9
N$271: J261.2 T261.1(E)
N$272: J262.2 T263.1(E)
N$273: J263.2 T264.1(E)
N$274: J261.1 J262.1 J263.1 J264.1 J265.1 J266.1 J267.1 J268.1 J269.1 J270.1 J271.1 J272.1 J273.1 J274.1 J275.1 J276.1 R11.2 T262.2(B) T278.2(B) T279.2(B) T280.2(B) T281.2(B) T282.2(B) T283.2(B) T284.2(B) T285.2(B) T286.2(B)
N$275: J276.2 T277.1(E)
N$276: J275.2 T276.1(E)
N$277: J274.2 T275.1(E)
N$278: J273.2 T274.1(E)
N$279: J272.2 T273.1(E)
N$280: J266.2 T267.1(E)
N$281: J265.2 T266.1(E)
N$282: J264.2 T265.1(E)
N$283: J267.2 T268.1(E)
N$284: J268.2 T269.1(E)
N$285: J269.2 T270.1(E)
N$286: J270.2 T271.1(E)
N$287: J271.2 T272.1(E)
N$288: J286.2 T286.1(E)
N$289: J277.2 T262.1(E)
N$290: J278.2 T278.1(E)
N$291: J279.2 T279.1(E)
N$292: J280.2 T280.1(E)
N$293: J281.2 T281.1(E)
N$294: J282.2 T282.1(E)
N$295: J283.2 T283.1(E)
N$296: J284.2 T284.1(E)
N$297: J285.2 T285.1(E)
N$298: J287.2 T287.1(E)
N$299: J288.2 T289.1(E)
N$300: J289.2 T290.1(E)
N$301: J287.1 J288.1 J289.1 J290.1 J291.1 J292.1 J293.1 J294.1 J295.1 J296.1 J297.1 J298.1 J299.1 J300.1 J301.1 J302.1 R12.2 T288.2(B) T304.2(B) T305.2(B) T306.2(B) T307.2(B) T308.2(B) T309.2(B) T310.2(B) T311.2(B) T312.2(B)
N$302: J302.2 T303.1(E)
N$303: J301.2 T302.1(E)
N$304: J300.2 T301.1(E)
N$305: J299.2 T300.1(E)
N$306: J298.2 T299.1(E)
N$307: J292.2 T293.1(E)
N$308: J291.2 T292.1(E)
N$309: J290.2 T291.1(E)
N$310: J293.2 T294.1(E)
N$311: J294.2 T295.1(E)
N$312: J295.2 T296.1(E)
N$313: J296.2 T297.1(E)
N$314: J297.2 T298.1(E)
N$315: J312.2 T312.1(E)
N$316: J303.2 T288.1(E)
N$317: J304.2 T304.1(E)
N$318: J305.2 T305.1(E)
N$319: J306.2 T306.1(E)
N$320: J307.2 T307.1(E)
N$321: J308.2 T308.1(E)
N$322: J309.2 T309.1(E)
N$323: J310.2 T310.1(E)
N$324: J311.2 T311.1(E)
Q0: J277.1 J303.1 ; also sheet 2,3,4,5,6,8,9
Q1: J278.1 J304.1 ; also sheet 2,3,4,5,6,8,9
Q2: J279.1 J305.1 ; also sheet 2,3,4,5,6,8,9
Q3: J280.1 J306.1 ; also sheet 2,3,4,5,6,8,9
Q4: J281.1 J307.1 ; also sheet 2,3,4,5,6,8,9
Q5: J282.1 J308.1 ; also sheet 2,3,4,5,6,8,9
Q6: J283.1 J309.1 ; also sheet 2,3,4,5,6,8,9
Q7: J284.1 J310.1 ; also sheet 2,3,4,5,6,8,9
Q8: J285.1 J311.1 ; also sheet 2,3,4,5,6,8,9
Q9: J286.1 J312.1 ; also sheet 2,3,4,5,6,8,9
VCC: C11.2 C12.2 R11.1 R12.1 T262.3(C) T278.3(C) T279.3(C) T280.3(C) T281.3(C) T282.3(C) T283.3(C) T284.3(C) T285.3(C) T286.3(C) T288.3(C) T304.3(C) T305.3(C) T306.3(C) T307.3(C) T308.3(C) T309.3(C) T310.3(C) T311.3(C) T312.3(C) ; also sheet 1,2,3,4,5,6,8,9

### Buses
B$1
B$3

### Notes on the sheet
- (c) Dieter Müller
- 2005,2006 | D
- 1.0